# Altium project COM Board.PrjPcb (part 1 of 2)
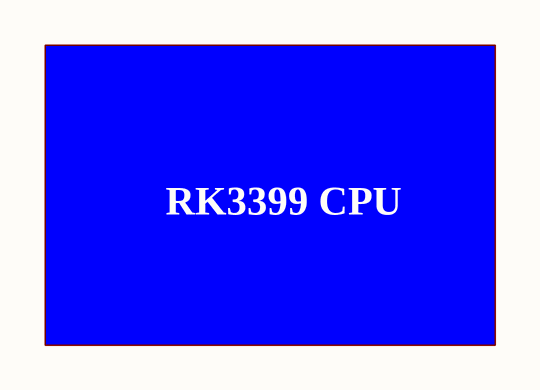
[diagram p0: Block Diagram.SchDoc]
9 sheets, 81 parts. Net scope: global (net labels, ports and power ports of the same name join across sheets).
Sheets:
  Block Diagram.SchDoc
  RK3399_LPDDR4_Pins.SchDoc
  SDRAM0.SchDoc
  SDRAM_1.SchDoc
  EMMC_RK3399.SchDoc
  PowerPins_RK3399.SchDoc
  PMIC_RK808.SchDoc
  EMMC-SDMMC-PCIe-ADC.SchDoc
  System PMU pins.SchDoc

## Sheet Block Diagram.SchDoc
size A3; SheetNumber: 1; SheetTotal: 1

### Notes on the sheet
- RK3399 CPU

## Sheet RK3399_LPDDR4_Pins.SchDoc
size A3; SheetNumber: 2; SheetTotal: 6
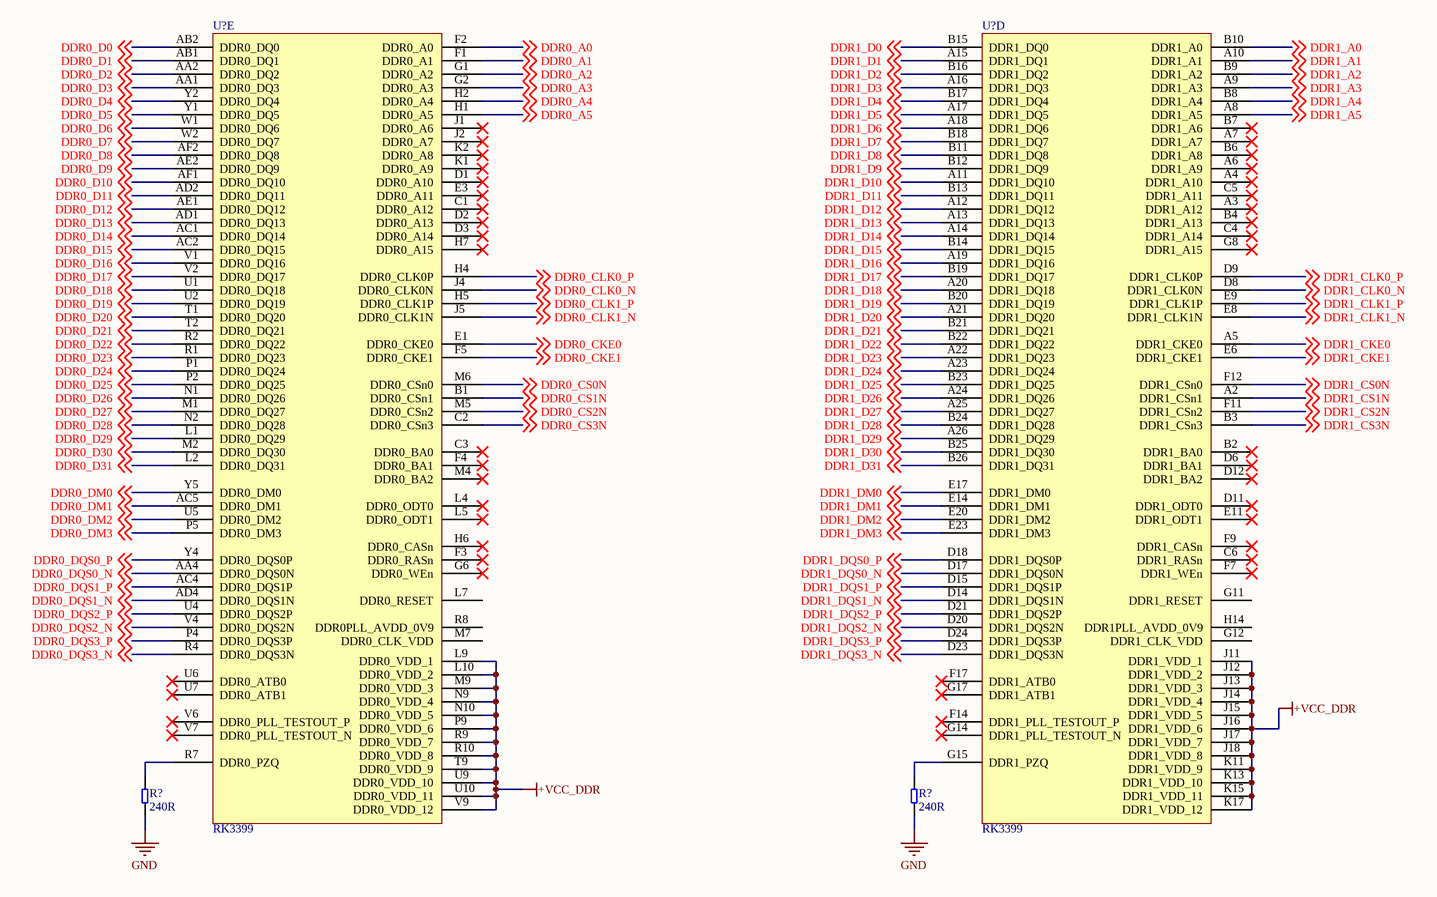
[diagram p1: RK3399_LPDDR4_Pins.SchDoc]

### Parts
(Parts that share a designator on the sheet are numbered #1, #2 ... from top to bottom, then left to right.)
R?#1  240R  [RES_0201]
R?#2  240R  [RES_0201]
U?#1  RK3399  [BGA828_RK3399]  (part E of 24)
U?#2  RK3399  [BGA828_RK3399]  (part D of 24)

### Nets
+VCC_DDR: U?#1.L9(DDR0_VDD_1) U?#1.L10(DDR0_VDD_2) U?#1.M9(DDR0_VDD_3) U?#1.N9(DDR0_VDD_4) U?#1.N10(DDR0_VDD_5) U?#1.P9(DDR0_VDD_6) U?#1.R9(DDR0_VDD_7) U?#1.R10(DDR0_VDD_8) U?#1.T9(DDR0_VDD_9) U?#1.U9(DDR0_VDD_10) U?#1.U10(DDR0_VDD_11) U?#1.V9(DDR0_VDD_12) U?#2.J11(DDR1_VDD_1) U?#2.J12(DDR1_VDD_2) U?#2.J13(DDR1_VDD_3) U?#2.J14(DDR1_VDD_4) U?#2.J15(DDR1_VDD_5) U?#2.J16(DDR1_VDD_6) U?#2.J17(DDR1_VDD_7) U?#2.J18(DDR1_VDD_8) U?#2.K11(DDR1_VDD_9) U?#2.K13(DDR1_VDD_10) U?#2.K15(DDR1_VDD_11) U?#2.K17(DDR1_VDD_12)
GND: R?#1.1 R?#2.1
DDR0_A0: U?#1.F2(DDR0_A0) ; off-sheet DDR0_A0
DDR0_A1: U?#1.F1(DDR0_A1) ; off-sheet DDR0_A1
DDR0_A2: U?#1.G1(DDR0_A2) ; off-sheet DDR0_A2
DDR0_A3: U?#1.G2(DDR0_A3) ; off-sheet DDR0_A3
DDR0_A4: U?#1.H2(DDR0_A4) ; off-sheet DDR0_A4
DDR0_A5: U?#1.H1(DDR0_A5) ; off-sheet DDR0_A5
DDR0_CKE0: U?#1.E1(DDR0_CKE0) ; off-sheet DDR0_CKE0
DDR0_CKE1: U?#1.F5(DDR0_CKE1) ; off-sheet DDR0_CKE1
DDR0_CLK0_N: U?#1.J4(DDR0_CLK0N) ; off-sheet DDR0_CLK0_N
DDR0_CLK0_P: U?#1.H4(DDR0_CLK0P) ; off-sheet DDR0_CLK0_P
DDR0_CLK1_N: U?#1.J5(DDR0_CLK1N) ; off-sheet DDR0_CLK1_N
DDR0_CLK1_P: U?#1.H5(DDR0_CLK1P) ; off-sheet DDR0_CLK1_P
DDR0_CS0N: U?#1.M6(DDR0_CSn0) ; off-sheet DDR0_CS0N
DDR0_CS1N: U?#1.B1(DDR0_CSn1) ; off-sheet DDR0_CS1N
DDR0_CS2N: U?#1.M5(DDR0_CSn2) ; off-sheet DDR0_CS2N
DDR0_CS3N: U?#1.C2(DDR0_CSn3) ; off-sheet DDR0_CS3N
DDR0_D0: U?#1.AB2(DDR0_DQ0) ; off-sheet DDR0_D0
DDR0_D1: U?#1.AB1(DDR0_DQ1) ; off-sheet DDR0_D1
DDR0_D2: U?#1.AA2(DDR0_DQ2) ; off-sheet DDR0_D2
DDR0_D3: U?#1.AA1(DDR0_DQ3) ; off-sheet DDR0_D3
DDR0_D4: U?#1.Y2(DDR0_DQ4) ; off-sheet DDR0_D4
DDR0_D5: U?#1.Y1(DDR0_DQ5) ; off-sheet DDR0_D5
DDR0_D6: U?#1.W1(DDR0_DQ6) ; off-sheet DDR0_D6
DDR0_D7: U?#1.W2(DDR0_DQ7) ; off-sheet DDR0_D7
DDR0_D8: U?#1.AF2(DDR0_DQ8) ; off-sheet DDR0_D8
DDR0_D9: U?#1.AE2(DDR0_DQ9) ; off-sheet DDR0_D9
DDR0_D10: U?#1.AF1(DDR0_DQ10) ; off-sheet DDR0_D10
DDR0_D11: U?#1.AD2(DDR0_DQ11) ; off-sheet DDR0_D11
DDR0_D12: U?#1.AE1(DDR0_DQ12) ; off-sheet DDR0_D12
DDR0_D13: U?#1.AD1(DDR0_DQ13) ; off-sheet DDR0_D13
DDR0_D14: U?#1.AC1(DDR0_DQ14) ; off-sheet DDR0_D14
DDR0_D15: U?#1.AC2(DDR0_DQ15) ; off-sheet DDR0_D15
DDR0_D16: U?#1.V1(DDR0_DQ16) ; off-sheet DDR0_D16
DDR0_D17: U?#1.V2(DDR0_DQ17) ; off-sheet DDR0_D17
DDR0_D18: U?#1.U1(DDR0_DQ18) ; off-sheet DDR0_D18
DDR0_D19: U?#1.U2(DDR0_DQ19) ; off-sheet DDR0_D19
DDR0_D20: U?#1.T1(DDR0_DQ20) ; off-sheet DDR0_D20
DDR0_D21: U?#1.T2(DDR0_DQ21) ; off-sheet DDR0_D21
DDR0_D22: U?#1.R2(DDR0_DQ22) ; off-sheet DDR0_D22
DDR0_D23: U?#1.R1(DDR0_DQ23) ; off-sheet DDR0_D23
DDR0_D24: U?#1.P1(DDR0_DQ24) ; off-sheet DDR0_D24
DDR0_D25: U?#1.P2(DDR0_DQ25) ; off-sheet DDR0_D25
DDR0_D26: U?#1.N1(DDR0_DQ26) ; off-sheet DDR0_D26
DDR0_D27: U?#1.M1(DDR0_DQ27) ; off-sheet DDR0_D27
DDR0_D28: U?#1.N2(DDR0_DQ28) ; off-sheet DDR0_D28
DDR0_D29: U?#1.L1(DDR0_DQ29) ; off-sheet DDR0_D29
DDR0_D30: U?#1.M2(DDR0_DQ30) ; off-sheet DDR0_D30
DDR0_D31: U?#1.L2(DDR0_DQ31) ; off-sheet DDR0_D31
DDR0_DM0: U?#1.Y5(DDR0_DM0) ; off-sheet DDR0_DM0
DDR0_DM1: U?#1.AC5(DDR0_DM1) ; off-sheet DDR0_DM1
DDR0_DM2: U?#1.U5(DDR0_DM2) ; off-sheet DDR0_DM2
DDR0_DM3: U?#1.P5(DDR0_DM3) ; off-sheet DDR0_DM3
DDR0_DQS0_N: U?#1.AA4(DDR0_DQS0N) ; off-sheet DDR0_DQS0_N
DDR0_DQS0_P: U?#1.Y4(DDR0_DQS0P) ; off-sheet DDR0_DQS0_P
DDR0_DQS1_N: U?#1.AD4(DDR0_DQS1N) ; off-sheet DDR0_DQS1_N
DDR0_DQS1_P: U?#1.AC4(DDR0_DQS1P) ; off-sheet DDR0_DQS1_P
DDR0_DQS2_N: U?#1.V4(DDR0_DQS2N) ; off-sheet DDR0_DQS2_N
DDR0_DQS2_P: U?#1.U4(DDR0_DQS2P) ; off-sheet DDR0_DQS2_P
DDR0_DQS3_N: U?#1.R4(DDR0_DQS3N) ; off-sheet DDR0_DQS3_N
DDR0_DQS3_P: U?#1.P4(DDR0_DQS3P) ; off-sheet DDR0_DQS3_P
DDR1_A0: U?#2.B10(DDR1_A0) ; off-sheet DDR1_A0
DDR1_A1: U?#2.A10(DDR1_A1) ; off-sheet DDR1_A1
DDR1_A2: U?#2.B9(DDR1_A2) ; off-sheet DDR1_A2
DDR1_A3: U?#2.A9(DDR1_A3) ; off-sheet DDR1_A3
DDR1_A4: U?#2.B8(DDR1_A4) ; off-sheet DDR1_A4
DDR1_A5: U?#2.A8(DDR1_A5) ; off-sheet DDR1_A5
DDR1_CKE0: U?#2.A5(DDR1_CKE0) ; off-sheet DDR1_CKE0
DDR1_CKE1: U?#2.E6(DDR1_CKE1) ; off-sheet DDR1_CKE1
DDR1_CLK0_N: U?#2.D8(DDR1_CLK0N) ; off-sheet DDR1_CLK0_N
DDR1_CLK0_P: U?#2.D9(DDR1_CLK0P) ; off-sheet DDR1_CLK0_P
DDR1_CLK1_N: U?#2.E8(DDR1_CLK1N) ; off-sheet DDR1_CLK1_N
DDR1_CLK1_P: U?#2.E9(DDR1_CLK1P) ; off-sheet DDR1_CLK1_P
DDR1_CS0N: U?#2.F12(DDR1_CSn0) ; off-sheet DDR1_CS0N
DDR1_CS1N: U?#2.A2(DDR1_CSn1) ; off-sheet DDR1_CS1N
DDR1_CS2N: U?#2.F11(DDR1_CSn2) ; off-sheet DDR1_CS2N
DDR1_CS3N: U?#2.B3(DDR1_CSn3) ; off-sheet DDR1_CS3N
DDR1_D0: U?#2.B15(DDR1_DQ0) ; off-sheet DDR1_D0
DDR1_D1: U?#2.A15(DDR1_DQ1) ; off-sheet DDR1_D1
DDR1_D2: U?#2.B16(DDR1_DQ2) ; off-sheet DDR1_D2
DDR1_D3: U?#2.A16(DDR1_DQ3) ; off-sheet DDR1_D3
DDR1_D4: U?#2.B17(DDR1_DQ4) ; off-sheet DDR1_D4
DDR1_D5: U?#2.A17(DDR1_DQ5) ; off-sheet DDR1_D5
DDR1_D6: U?#2.A18(DDR1_DQ6) ; off-sheet DDR1_D6
DDR1_D7: U?#2.B18(DDR1_DQ7) ; off-sheet DDR1_D7
DDR1_D8: U?#2.B11(DDR1_DQ8) ; off-sheet DDR1_D8
DDR1_D9: U?#2.B12(DDR1_DQ9) ; off-sheet DDR1_D9
DDR1_D10: U?#2.A11(DDR1_DQ10) ; off-sheet DDR1_D10
DDR1_D11: U?#2.B13(DDR1_DQ11) ; off-sheet DDR1_D11
DDR1_D12: U?#2.A12(DDR1_DQ12) ; off-sheet DDR1_D12
DDR1_D13: U?#2.A13(DDR1_DQ13) ; off-sheet DDR1_D13
DDR1_D14: U?#2.A14(DDR1_DQ14) ; off-sheet DDR1_D14
DDR1_D15: U?#2.B14(DDR1_DQ15) ; off-sheet DDR1_D15
DDR1_D16: U?#2.A19(DDR1_DQ16) ; off-sheet DDR1_D16
DDR1_D17: U?#2.B19(DDR1_DQ17) ; off-sheet DDR1_D17
DDR1_D18: U?#2.A20(DDR1_DQ18) ; off-sheet DDR1_D18
DDR1_D19: U?#2.B20(DDR1_DQ19) ; off-sheet DDR1_D19
DDR1_D20: U?#2.A21(DDR1_DQ20) ; off-sheet DDR1_D20
DDR1_D21: U?#2.B21(DDR1_DQ21) ; off-sheet DDR1_D21
DDR1_D22: U?#2.B22(DDR1_DQ22) ; off-sheet DDR1_D22
DDR1_D23: U?#2.A22(DDR1_DQ23) ; off-sheet DDR1_D23
DDR1_D24: U?#2.A23(DDR1_DQ24) ; off-sheet DDR1_D24
DDR1_D25: U?#2.B23(DDR1_DQ25) ; off-sheet DDR1_D25
DDR1_D26: U?#2.A24(DDR1_DQ26) ; off-sheet DDR1_D26
DDR1_D27: U?#2.A25(DDR1_DQ27) ; off-sheet DDR1_D27
DDR1_D28: U?#2.B24(DDR1_DQ28) ; off-sheet DDR1_D28
DDR1_D29: U?#2.A26(DDR1_DQ29) ; off-sheet DDR1_D29
DDR1_D30: U?#2.B25(DDR1_DQ30) ; off-sheet DDR1_D30
DDR1_D31: U?#2.B26(DDR1_DQ31) ; off-sheet DDR1_D31
DDR1_DM0: U?#2.E17(DDR1_DM0) ; off-sheet DDR1_DM0
DDR1_DM1: U?#2.E14(DDR1_DM1) ; off-sheet DDR1_DM1
DDR1_DM2: U?#2.E20(DDR1_DM2) ; off-sheet DDR1_DM2
DDR1_DM3: U?#2.E23(DDR1_DM3) ; off-sheet DDR1_DM3
DDR1_DQS0_N: U?#2.D17(DDR1_DQS0N) ; off-sheet DDR1_DQS0_N
DDR1_DQS0_P: U?#2.D18(DDR1_DQS0P) ; off-sheet DDR1_DQS0_P
DDR1_DQS1_N: U?#2.D14(DDR1_DQS1N) ; off-sheet DDR1_DQS1_N
DDR1_DQS1_P: U?#2.D15(DDR1_DQS1P) ; off-sheet DDR1_DQS1_P
DDR1_DQS2_N: U?#2.D20(DDR1_DQS2N) ; off-sheet DDR1_DQS2_N
DDR1_DQS2_P: U?#2.D21(DDR1_DQS2P) ; off-sheet DDR1_DQS2_P
DDR1_DQS3_N: U?#2.D23(DDR1_DQS3N) ; off-sheet DDR1_DQS3_N
DDR1_DQS3_P: U?#2.D24(DDR1_DQS3P) ; off-sheet DDR1_DQS3_P
NetR?#1_2: R?#1.2 U?#1.R7(DDR0_PZQ)
NetR?#2_2: R?#2.2 U?#2.G15(DDR1_PZQ)

Not connected (* = marked no-connect by the designer): U?#1 C1(DDR0_A12)* C3(DDR0_BA0)* D1(DDR0_A10)* D2(DDR0_A13)* D3(DDR0_A14)* E3(DDR0_A11)* F3(DDR0_RASn)* F4(DDR0_BA1)* G6(DDR0_WEn)* H6(DDR0_CASn)* H7(DDR0_A15)* J1(DDR0_A6)* J2(DDR0_A7)* K1(DDR0_A9)* K2(DDR0_A8)* L4(DDR0_ODT0)* L5(DDR0_ODT1)* L7(DDR0_RESET) M4(DDR0_BA2)* M7(DDR0_CLK_VDD) R8(DDR0PLL_AVDD_0V9) U6(DDR0_ATB0)* U7(DDR0_ATB1)* V6(DDR0_PLL_TESTOUT_P)* V7(DDR0_PLL_TESTOUT_N)*; U?#2 A3(DDR1_A12)* A4(DDR1_A10)* A6(DDR1_A9)* A7(DDR1_A7)* B2(DDR1_BA0)* B4(DDR1_A13)* B6(DDR1_A8)* B7(DDR1_A6)* C4(DDR1_A14)* C5(DDR1_A11)* C6(DDR1_RASn)* D6(DDR1_BA1)* D11(DDR1_ODT0)* D12(DDR1_BA2)* E11(DDR1_ODT1)* F7(DDR1_WEn)* F9(DDR1_CASn)* F14(DDR1_PLL_TESTOUT_P)* F17(DDR1_ATB0)* G8(DDR1_A15)* G11(DDR1_RESET) G12(DDR1_CLK_VDD) G14(DDR1_PLL_TESTOUT_N)* G17(DDR1_ATB1)* H14(DDR1PLL_AVDD_0V9)

### Library data of the parts
R?#1 R?#2 = RES_240R-0.05W-1%-0201: 240 Ohms ±1% 0.05W, 1/20W Chip Resistor 0201 (0603 Metric) Thick Film /; Manufacturer: Yageo; Manufacturer Part Number: RC0201FR-07240RL; Case/Package: 0201; Supplier-1: Digikey
U?#1 U?#2 = IC_RK3399-FCBGA828: RK3399 is a low power, high performance processor for computing, personal mobile.; Manufacturer: Rockchip; Manufacturer Part Number: RK3399; Case/Package: FCBGA828; Supplier-1: Rockchip

## Sheet SDRAM0.SchDoc
size A3; SheetNumber: 3; SheetTotal: 6
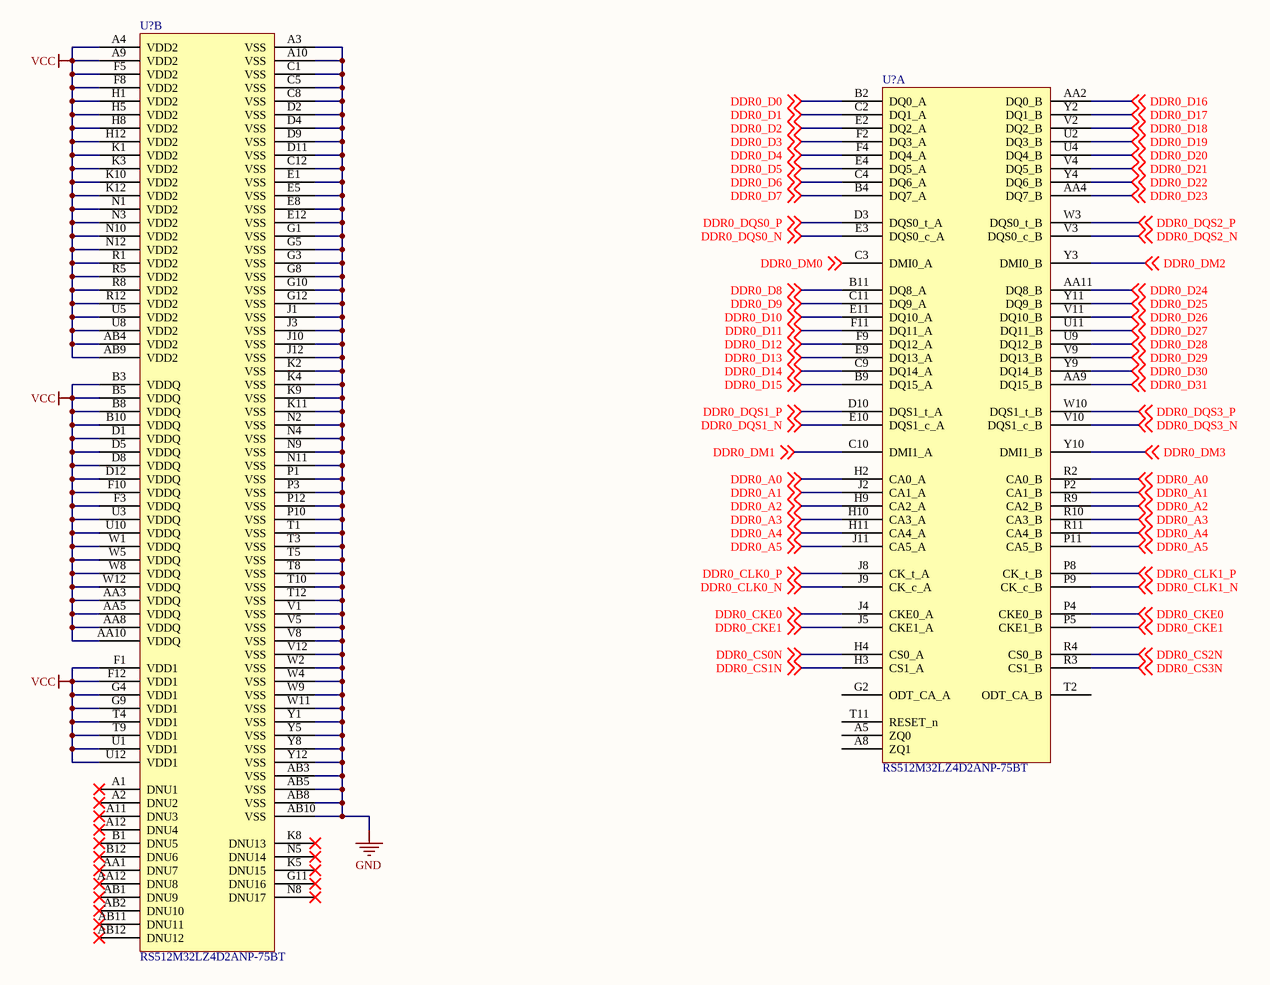
[diagram p2: SDRAM0.SchDoc]

### Parts
(Parts that share a designator on the sheet are numbered #1, #2 ... from top to bottom, then left to right.)
U?#3  RS512M32LZ4D2ANP-75BT  [FBGA200_SMD]  (part B of 2)
U?#4  RS512M32LZ4D2ANP-75BT  [FBGA200_SMD]  (part A of 2)

### Nets
GND: U?#3.A3(VSS) U?#3.A10(VSS) U?#3.AB3(VSS) U?#3.AB5(VSS) U?#3.AB8(VSS) U?#3.AB10(VSS) U?#3.C1(VSS) U?#3.C5(VSS) U?#3.C8(VSS) U?#3.C12(VSS) U?#3.D2(VSS) U?#3.D4(VSS) U?#3.D9(VSS) U?#3.D11(VSS) U?#3.E1(VSS) U?#3.E5(VSS) U?#3.E8(VSS) U?#3.E12(VSS) U?#3.G1(VSS) U?#3.G3(VSS) U?#3.G5(VSS) U?#3.G8(VSS) U?#3.G10(VSS) U?#3.G12(VSS) U?#3.J1(VSS) U?#3.J3(VSS) U?#3.J10(VSS) U?#3.J12(VSS) U?#3.K2(VSS) U?#3.K4(VSS) U?#3.K9(VSS) U?#3.K11(VSS) U?#3.N2(VSS) U?#3.N4(VSS) U?#3.N9(VSS) U?#3.N11(VSS) U?#3.P1(VSS) U?#3.P3(VSS) U?#3.P10(VSS) U?#3.P12(VSS) U?#3.T1(VSS) U?#3.T3(VSS) U?#3.T5(VSS) U?#3.T8(VSS) U?#3.T10(VSS) U?#3.T12(VSS) U?#3.V1(VSS) U?#3.V5(VSS) U?#3.V8(VSS) U?#3.V12(VSS) U?#3.W2(VSS) U?#3.W4(VSS) U?#3.W9(VSS) U?#3.W11(VSS) U?#3.Y1(VSS) U?#3.Y5(VSS) U?#3.Y8(VSS) U?#3.Y12(VSS)
VCC: U?#3.A4(VDD2) U?#3.A9(VDD2) U?#3.AA3(VDDQ) U?#3.AA5(VDDQ) U?#3.AA8(VDDQ) U?#3.AA10(VDDQ) U?#3.AB4(VDD2) U?#3.AB9(VDD2) U?#3.B3(VDDQ) U?#3.B5(VDDQ) U?#3.B8(VDDQ) U?#3.B10(VDDQ) U?#3.D1(VDDQ) U?#3.D5(VDDQ) U?#3.D8(VDDQ) U?#3.D12(VDDQ) U?#3.F1(VDD1) U?#3.F3(VDDQ) U?#3.F5(VDD2) U?#3.F8(VDD2) U?#3.F10(VDDQ) U?#3.F12(VDD1) U?#3.G4(VDD1) U?#3.G9(VDD1) U?#3.H1(VDD2) U?#3.H5(VDD2) U?#3.H8(VDD2) U?#3.H12(VDD2) U?#3.K1(VDD2) U?#3.K3(VDD2) U?#3.K10(VDD2) U?#3.K12(VDD2) U?#3.N1(VDD2) U?#3.N3(VDD2) U?#3.N10(VDD2) U?#3.N12(VDD2) U?#3.R1(VDD2) U?#3.R5(VDD2) U?#3.R8(VDD2) U?#3.R12(VDD2) U?#3.T4(VDD1) U?#3.T9(VDD1) U?#3.U1(VDD1) U?#3.U3(VDDQ) U?#3.U5(VDD2) U?#3.U8(VDD2) U?#3.U10(VDDQ) U?#3.U12(VDD1) U?#3.W1(VDDQ) U?#3.W5(VDDQ) U?#3.W8(VDDQ) U?#3.W12(VDDQ)
DDR0_A0: U?#4.H2(CA0_A) U?#4.R2(CA0_B) ; off-sheet DDR0_A0
DDR0_A1: U?#4.J2(CA1_A) U?#4.P2(CA1_B) ; off-sheet DDR0_A1
DDR0_A2: U?#4.H9(CA2_A) U?#4.R9(CA2_B) ; off-sheet DDR0_A2
DDR0_A3: U?#4.H10(CA3_A) U?#4.R10(CA3_B) ; off-sheet DDR0_A3
DDR0_A4: U?#4.H11(CA4_A) U?#4.R11(CA4_B) ; off-sheet DDR0_A4
DDR0_A5: U?#4.J11(CA5_A) U?#4.P11(CA5_B) ; off-sheet DDR0_A5
DDR0_CKE0: U?#4.J4(CKE0_A) U?#4.P4(CKE0_B) ; off-sheet DDR0_CKE0
DDR0_CKE1: U?#4.J5(CKE1_A) U?#4.P5(CKE1_B) ; off-sheet DDR0_CKE1
DDR0_CLK0_N: U?#4.J9(CK_c_A) ; off-sheet DDR0_CLK0_N
DDR0_CLK0_P: U?#4.J8(CK_t_A) ; off-sheet DDR0_CLK0_P
DDR0_CLK1_N: U?#4.P9(CK_c_B) ; off-sheet DDR0_CLK1_N
DDR0_CLK1_P: U?#4.P8(CK_t_B) ; off-sheet DDR0_CLK1_P
DDR0_CS0N: U?#4.H4(CS0_A) ; off-sheet DDR0_CS0N
DDR0_CS1N: U?#4.H3(CS1_A) ; off-sheet DDR0_CS1N
DDR0_CS2N: U?#4.R4(CS0_B) ; off-sheet DDR0_CS2N
DDR0_CS3N: U?#4.R3(CS1_B) ; off-sheet DDR0_CS3N
DDR0_D0: U?#4.B2(DQ0_A) ; off-sheet DDR0_D0
DDR0_D1: U?#4.C2(DQ1_A) ; off-sheet DDR0_D1
DDR0_D2: U?#4.E2(DQ2_A) ; off-sheet DDR0_D2
DDR0_D3: U?#4.F2(DQ3_A) ; off-sheet DDR0_D3
DDR0_D4: U?#4.F4(DQ4_A) ; off-sheet DDR0_D4
DDR0_D5: U?#4.E4(DQ5_A) ; off-sheet DDR0_D5
DDR0_D6: U?#4.C4(DQ6_A) ; off-sheet DDR0_D6
DDR0_D7: U?#4.B4(DQ7_A) ; off-sheet DDR0_D7
DDR0_D8: U?#4.B11(DQ8_A) ; off-sheet DDR0_D8
DDR0_D9: U?#4.C11(DQ9_A) ; off-sheet DDR0_D9
DDR0_D10: U?#4.E11(DQ10_A) ; off-sheet DDR0_D10
DDR0_D11: U?#4.F11(DQ11_A) ; off-sheet DDR0_D11
DDR0_D12: U?#4.F9(DQ12_A) ; off-sheet DDR0_D12
DDR0_D13: U?#4.E9(DQ13_A) ; off-sheet DDR0_D13
DDR0_D14: U?#4.C9(DQ14_A) ; off-sheet DDR0_D14
DDR0_D15: U?#4.B9(DQ15_A) ; off-sheet DDR0_D15
DDR0_D16: U?#4.AA2(DQ0_B) ; off-sheet DDR0_D16
DDR0_D17: U?#4.Y2(DQ1_B) ; off-sheet DDR0_D17
DDR0_D18: U?#4.V2(DQ2_B) ; off-sheet DDR0_D18
DDR0_D19: U?#4.U2(DQ3_B) ; off-sheet DDR0_D19
DDR0_D20: U?#4.U4(DQ4_B) ; off-sheet DDR0_D20
DDR0_D21: U?#4.V4(DQ5_B) ; off-sheet DDR0_D21
DDR0_D22: U?#4.Y4(DQ6_B) ; off-sheet DDR0_D22
DDR0_D23: U?#4.AA4(DQ7_B) ; off-sheet DDR0_D23
DDR0_D24: U?#4.AA11(DQ8_B) ; off-sheet DDR0_D24
DDR0_D25: U?#4.Y11(DQ9_B) ; off-sheet DDR0_D25
DDR0_D26: U?#4.V11(DQ10_B) ; off-sheet DDR0_D26
DDR0_D27: U?#4.U11(DQ11_B) ; off-sheet DDR0_D27
DDR0_D28: U?#4.U9(DQ12_B) ; off-sheet DDR0_D28
DDR0_D29: U?#4.V9(DQ13_B) ; off-sheet DDR0_D29
DDR0_D30: U?#4.Y9(DQ14_B) ; off-sheet DDR0_D30
DDR0_D31: U?#4.AA9(DQ15_B) ; off-sheet DDR0_D31
DDR0_DM0: U?#4.C3(DMI0_A) ; off-sheet DDR0_DM0
DDR0_DM1: U?#4.C10(DMI1_A) ; off-sheet DDR0_DM1
DDR0_DM2: U?#4.Y3(DMI0_B) ; off-sheet DDR0_DM2
DDR0_DM3: U?#4.Y10(DMI1_B) ; off-sheet DDR0_DM3
DDR0_DQS0_N: U?#4.E3(DQS0_c_A) ; off-sheet DDR0_DQS0_N
DDR0_DQS0_P: U?#4.D3(DQS0_t_A) ; off-sheet DDR0_DQS0_P
DDR0_DQS1_N: U?#4.E10(DQS1_c_A) ; off-sheet DDR0_DQS1_N
DDR0_DQS1_P: U?#4.D10(DQS1_t_A) ; off-sheet DDR0_DQS1_P
DDR0_DQS2_N: U?#4.V3(DQS0_c_B) ; off-sheet DDR0_DQS2_N
DDR0_DQS2_P: U?#4.W3(DQS0_t_B) ; off-sheet DDR0_DQS2_P
DDR0_DQS3_N: U?#4.V10(DQS1_c_B) ; off-sheet DDR0_DQS3_N
DDR0_DQS3_P: U?#4.W10(DQS1_t_B) ; off-sheet DDR0_DQS3_P

Not connected (* = marked no-connect by the designer): U?#3 A1(DNU1)* A2(DNU2)* A11(DNU3)* A12(DNU4)* AA1(DNU7)* AA12(DNU8)* AB1(DNU9)* AB2(DNU10)* AB11(DNU11)* AB12(DNU12)* B1(DNU5)* B12(DNU6)* G11(DNU16)* K5(DNU15)* K8(DNU13)* N5(DNU14)* N8(DNU17)*; U?#4 A5(ZQ0) A8(ZQ1) G2(ODT_CA_A) T2(ODT_CA_B) T11(RESET_n)

### Library data of the parts
U?#3 U?#4 = IC_RS512M32LZ4D2ANP-75BT: LPDDR4/4X Package FBGA 200b Density 4Gbit~64Gbit Operating Temperature Range：-25~85℃ Speed：2667Mbps/3200Mbps/3733Mbps Voltage：VDD1/VDD2/VDDQ= 1.8 / 1.1 / 1.1 V（LPDDR4）VDD1/VDD2/VDDQ = 1.8 / 1.1 / 0.6 V（LPDDR4X）Approved Verification Platform：MTK、Spreadtrum; Manufacturer: RAYSON; Manufacturer Part Number: RS512M32LZ4D2ANP-75BT; Case/Package: FBGA 200b; Supplier-1: RAYSON

## Sheet SDRAM_1.SchDoc
size A3; SheetNumber: 4; SheetTotal: 6
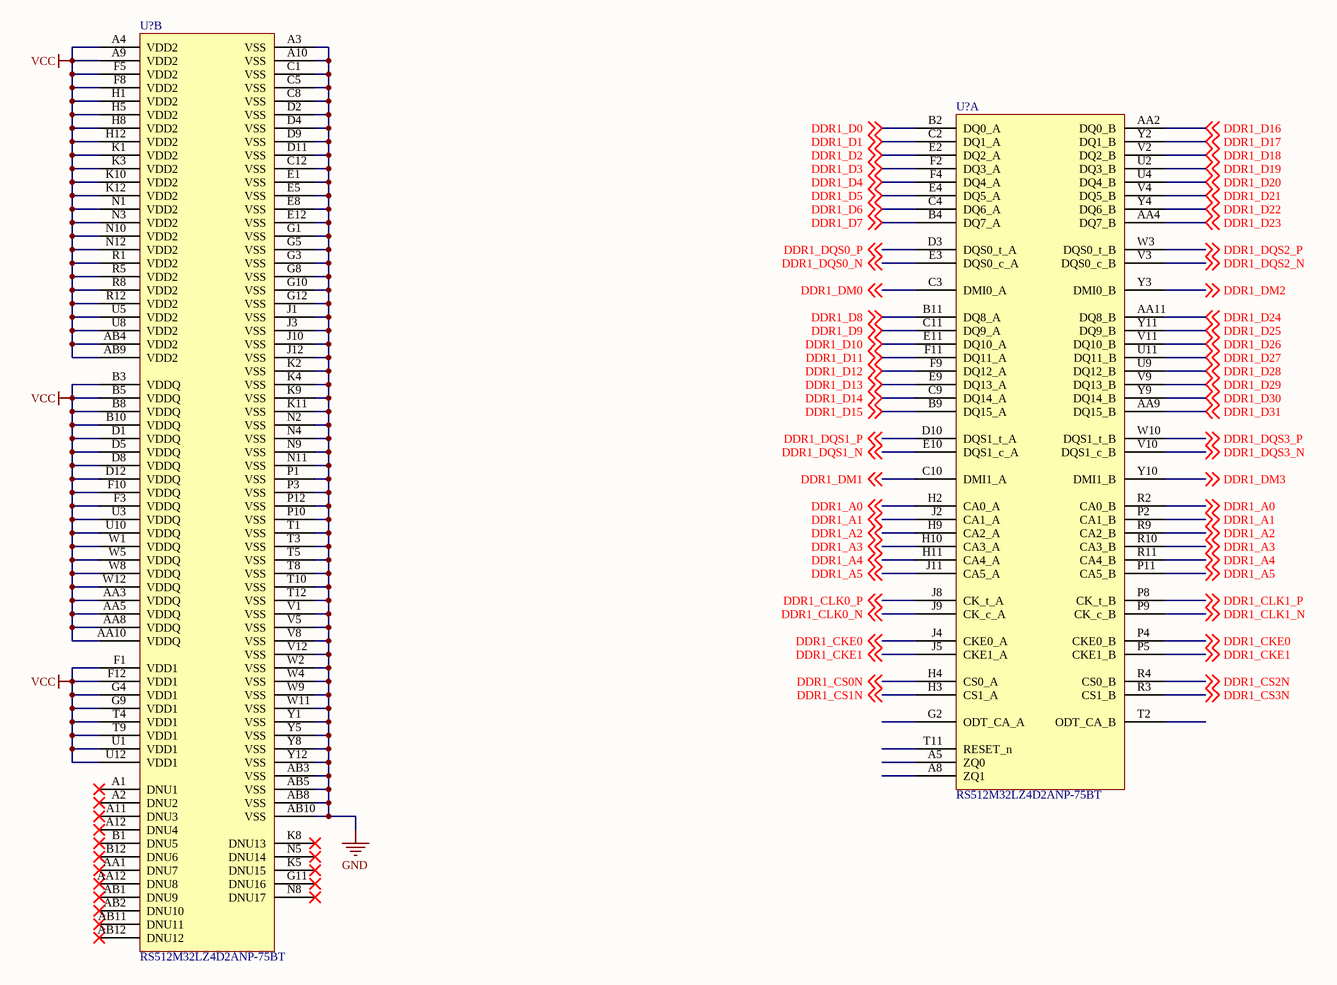
[diagram p3: SDRAM_1.SchDoc]

### Parts
(Parts that share a designator on the sheet are numbered #1, #2 ... from top to bottom, then left to right.)
U?#5  RS512M32LZ4D2ANP-75BT  [FBGA200_SMD]  (part B of 2)
U?#6  RS512M32LZ4D2ANP-75BT  [FBGA200_SMD]  (part A of 2)

### Nets
GND: U?#5.A3(VSS) U?#5.A10(VSS) U?#5.AB3(VSS) U?#5.AB5(VSS) U?#5.AB8(VSS) U?#5.AB10(VSS) U?#5.C1(VSS) U?#5.C5(VSS) U?#5.C8(VSS) U?#5.C12(VSS) U?#5.D2(VSS) U?#5.D4(VSS) U?#5.D9(VSS) U?#5.D11(VSS) U?#5.E1(VSS) U?#5.E5(VSS) U?#5.E8(VSS) U?#5.E12(VSS) U?#5.G1(VSS) U?#5.G3(VSS) U?#5.G5(VSS) U?#5.G8(VSS) U?#5.G10(VSS) U?#5.G12(VSS) U?#5.J1(VSS) U?#5.J3(VSS) U?#5.J10(VSS) U?#5.J12(VSS) U?#5.K2(VSS) U?#5.K4(VSS) U?#5.K9(VSS) U?#5.K11(VSS) U?#5.N2(VSS) U?#5.N4(VSS) U?#5.N9(VSS) U?#5.N11(VSS) U?#5.P1(VSS) U?#5.P3(VSS) U?#5.P10(VSS) U?#5.P12(VSS) U?#5.T1(VSS) U?#5.T3(VSS) U?#5.T5(VSS) U?#5.T8(VSS) U?#5.T10(VSS) U?#5.T12(VSS) U?#5.V1(VSS) U?#5.V5(VSS) U?#5.V8(VSS) U?#5.V12(VSS) U?#5.W2(VSS) U?#5.W4(VSS) U?#5.W9(VSS) U?#5.W11(VSS) U?#5.Y1(VSS) U?#5.Y5(VSS) U?#5.Y8(VSS) U?#5.Y12(VSS)
VCC: U?#5.A4(VDD2) U?#5.A9(VDD2) U?#5.AA3(VDDQ) U?#5.AA5(VDDQ) U?#5.AA8(VDDQ) U?#5.AA10(VDDQ) U?#5.AB4(VDD2) U?#5.AB9(VDD2) U?#5.B3(VDDQ) U?#5.B5(VDDQ) U?#5.B8(VDDQ) U?#5.B10(VDDQ) U?#5.D1(VDDQ) U?#5.D5(VDDQ) U?#5.D8(VDDQ) U?#5.D12(VDDQ) U?#5.F1(VDD1) U?#5.F3(VDDQ) U?#5.F5(VDD2) U?#5.F8(VDD2) U?#5.F10(VDDQ) U?#5.F12(VDD1) U?#5.G4(VDD1) U?#5.G9(VDD1) U?#5.H1(VDD2) U?#5.H5(VDD2) U?#5.H8(VDD2) U?#5.H12(VDD2) U?#5.K1(VDD2) U?#5.K3(VDD2) U?#5.K10(VDD2) U?#5.K12(VDD2) U?#5.N1(VDD2) U?#5.N3(VDD2) U?#5.N10(VDD2) U?#5.N12(VDD2) U?#5.R1(VDD2) U?#5.R5(VDD2) U?#5.R8(VDD2) U?#5.R12(VDD2) U?#5.T4(VDD1) U?#5.T9(VDD1) U?#5.U1(VDD1) U?#5.U3(VDDQ) U?#5.U5(VDD2) U?#5.U8(VDD2) U?#5.U10(VDDQ) U?#5.U12(VDD1) U?#5.W1(VDDQ) U?#5.W5(VDDQ) U?#5.W8(VDDQ) U?#5.W12(VDDQ)
DDR1_A0: U?#6.H2(CA0_A) U?#6.R2(CA0_B) ; off-sheet DDR1_A0
DDR1_A1: U?#6.J2(CA1_A) U?#6.P2(CA1_B) ; off-sheet DDR1_A1
DDR1_A2: U?#6.H9(CA2_A) U?#6.R9(CA2_B) ; off-sheet DDR1_A2
DDR1_A3: U?#6.H10(CA3_A) U?#6.R10(CA3_B) ; off-sheet DDR1_A3
DDR1_A4: U?#6.H11(CA4_A) U?#6.R11(CA4_B) ; off-sheet DDR1_A4
DDR1_A5: U?#6.J11(CA5_A) U?#6.P11(CA5_B) ; off-sheet DDR1_A5
DDR1_CKE0: U?#6.J4(CKE0_A) U?#6.P4(CKE0_B) ; off-sheet DDR1_CKE0
DDR1_CKE1: U?#6.J5(CKE1_A) U?#6.P5(CKE1_B) ; off-sheet DDR1_CKE1
DDR1_CLK0_N: U?#6.J9(CK_c_A) ; off-sheet DDR1_CLK0_N
DDR1_CLK0_P: U?#6.J8(CK_t_A) ; off-sheet DDR1_CLK0_P
DDR1_CLK1_N: U?#6.P9(CK_c_B) ; off-sheet DDR1_CLK1_N
DDR1_CLK1_P: U?#6.P8(CK_t_B) ; off-sheet DDR1_CLK1_P
DDR1_CS0N: U?#6.H4(CS0_A) ; off-sheet DDR1_CS0N
DDR1_CS1N: U?#6.H3(CS1_A) ; off-sheet DDR1_CS1N
DDR1_CS2N: U?#6.R4(CS0_B) ; off-sheet DDR1_CS2N
DDR1_CS3N: U?#6.R3(CS1_B) ; off-sheet DDR1_CS3N
DDR1_D0: U?#6.B2(DQ0_A) ; off-sheet DDR1_D0
DDR1_D1: U?#6.C2(DQ1_A) ; off-sheet DDR1_D1
DDR1_D2: U?#6.E2(DQ2_A) ; off-sheet DDR1_D2
DDR1_D3: U?#6.F2(DQ3_A) ; off-sheet DDR1_D3
DDR1_D4: U?#6.F4(DQ4_A) ; off-sheet DDR1_D4
DDR1_D5: U?#6.E4(DQ5_A) ; off-sheet DDR1_D5
DDR1_D6: U?#6.C4(DQ6_A) ; off-sheet DDR1_D6
DDR1_D7: U?#6.B4(DQ7_A) ; off-sheet DDR1_D7
DDR1_D8: U?#6.B11(DQ8_A) ; off-sheet DDR1_D8
DDR1_D9: U?#6.C11(DQ9_A) ; off-sheet DDR1_D9
DDR1_D10: U?#6.E11(DQ10_A) ; off-sheet DDR1_D10
DDR1_D11: U?#6.F11(DQ11_A) ; off-sheet DDR1_D11
DDR1_D12: U?#6.F9(DQ12_A) ; off-sheet DDR1_D12
DDR1_D13: U?#6.E9(DQ13_A) ; off-sheet DDR1_D13
DDR1_D14: U?#6.C9(DQ14_A) ; off-sheet DDR1_D14
DDR1_D15: U?#6.B9(DQ15_A) ; off-sheet DDR1_D15
DDR1_D16: U?#6.AA2(DQ0_B) ; off-sheet DDR1_D16
DDR1_D17: U?#6.Y2(DQ1_B) ; off-sheet DDR1_D17
DDR1_D18: U?#6.V2(DQ2_B) ; off-sheet DDR1_D18
DDR1_D19: U?#6.U2(DQ3_B) ; off-sheet DDR1_D19
DDR1_D20: U?#6.U4(DQ4_B) ; off-sheet DDR1_D20
DDR1_D21: U?#6.V4(DQ5_B) ; off-sheet DDR1_D21
DDR1_D22: U?#6.Y4(DQ6_B) ; off-sheet DDR1_D22
DDR1_D23: U?#6.AA4(DQ7_B) ; off-sheet DDR1_D23
DDR1_D24: U?#6.AA11(DQ8_B) ; off-sheet DDR1_D24
DDR1_D25: U?#6.Y11(DQ9_B) ; off-sheet DDR1_D25
DDR1_D26: U?#6.V11(DQ10_B) ; off-sheet DDR1_D26
DDR1_D27: U?#6.U11(DQ11_B) ; off-sheet DDR1_D27
DDR1_D28: U?#6.U9(DQ12_B) ; off-sheet DDR1_D28
DDR1_D29: U?#6.V9(DQ13_B) ; off-sheet DDR1_D29
DDR1_D30: U?#6.Y9(DQ14_B) ; off-sheet DDR1_D30
DDR1_D31: U?#6.AA9(DQ15_B) ; off-sheet DDR1_D31
DDR1_DM0: U?#6.C3(DMI0_A) ; off-sheet DDR1_DM0
DDR1_DM1: U?#6.C10(DMI1_A) ; off-sheet DDR1_DM1
DDR1_DM2: U?#6.Y3(DMI0_B) ; off-sheet DDR1_DM2
DDR1_DM3: U?#6.Y10(DMI1_B) ; off-sheet DDR1_DM3
DDR1_DQS0_N: U?#6.E3(DQS0_c_A) ; off-sheet DDR1_DQS0_N
DDR1_DQS0_P: U?#6.D3(DQS0_t_A) ; off-sheet DDR1_DQS0_P
DDR1_DQS1_N: U?#6.E10(DQS1_c_A) ; off-sheet DDR1_DQS1_N
DDR1_DQS1_P: U?#6.D10(DQS1_t_A) ; off-sheet DDR1_DQS1_P
DDR1_DQS2_N: U?#6.V3(DQS0_c_B) ; off-sheet DDR1_DQS2_N
DDR1_DQS2_P: U?#6.W3(DQS0_t_B) ; off-sheet DDR1_DQS2_P
DDR1_DQS3_N: U?#6.V10(DQS1_c_B) ; off-sheet DDR1_DQS3_N
DDR1_DQS3_P: U?#6.W10(DQS1_t_B) ; off-sheet DDR1_DQS3_P

Not connected (* = marked no-connect by the designer): U?#5 A1(DNU1)* A2(DNU2)* A11(DNU3)* A12(DNU4)* AA1(DNU7)* AA12(DNU8)* AB1(DNU9)* AB2(DNU10)* AB11(DNU11)* AB12(DNU12)* B1(DNU5)* B12(DNU6)* G11(DNU16)* K5(DNU15)* K8(DNU13)* N5(DNU14)* N8(DNU17)*; U?#6 A5(ZQ0) A8(ZQ1) G2(ODT_CA_A) T2(ODT_CA_B) T11(RESET_n)

### Library data of the parts
U?#5 U?#6 = IC_RS512M32LZ4D2ANP-75BT: as U?#3 on sheet SDRAM0; Manufacturer Part Number: RS512M32LZ4D2ANP-75BT; Case/Package: FBGA 200b; Supplier-1: RAYSON

## Sheet EMMC_RK3399.SchDoc
size A3; SheetNumber: 5; SheetTotal: 6
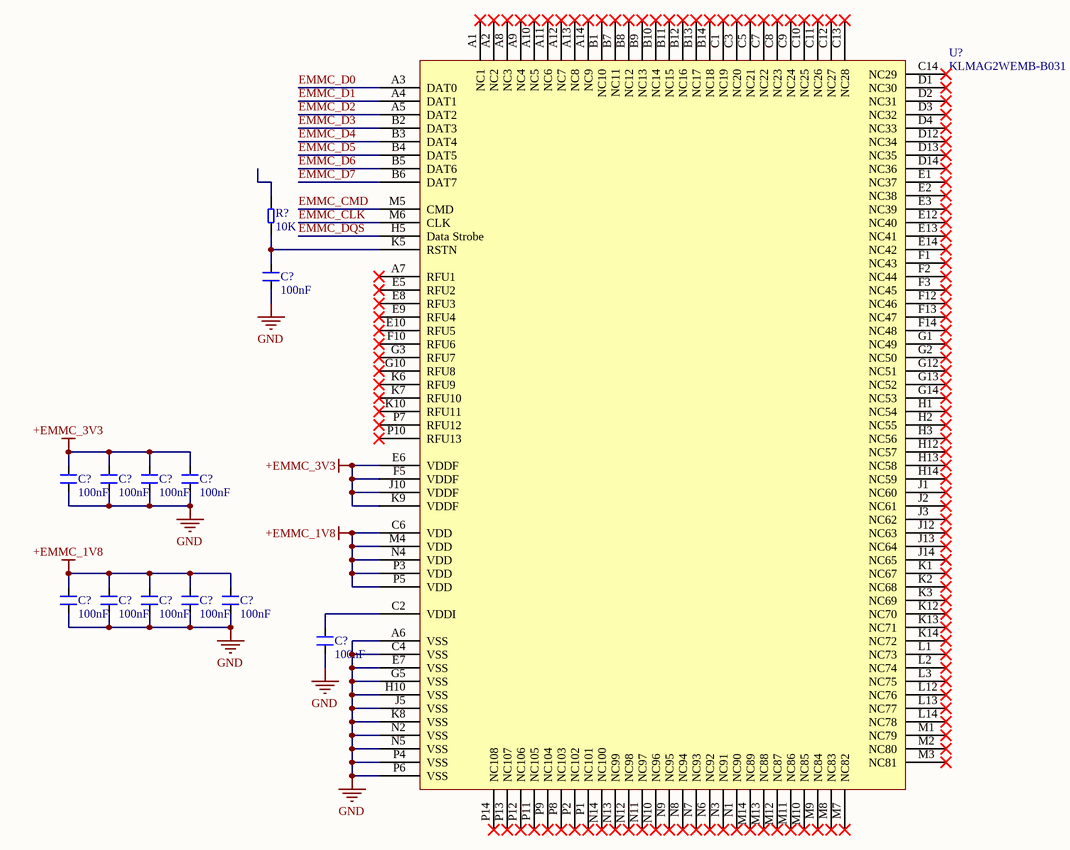
[diagram p4: EMMC_RK3399.SchDoc]

### Parts
(Parts that share a designator on the sheet are numbered #1, #2 ... from top to bottom, then left to right.)
C?#1  100nF  [CAP_0201]
C?#2  100nF  [CAP_0201]
C?#3  100nF  [CAP_0201]
C?#4  100nF  [CAP_0201]
C?#5  100nF  [CAP_0201]
C?#6  100nF  [CAP_0201]
C?#7  100nF  [CAP_0201]
C?#8  100nF  [CAP_0201]
C?#9  100nF  [CAP_0201]
C?#10  100nF  [CAP_0201]
C?#11  100nF  [CAP_0201]
R?#3  10K  [RES_0201]
U?#7  KLMAG2WEMB-B031  [BGA153_IC_KLMAG2WEMB-B031]

### Nets
+EMMC_1V8: C?#6.2 C?#7.2 C?#8.2 C?#9.2 C?#10.2 U?#7.C6(VDD) U?#7.M4(VDD) U?#7.N4(VDD) U?#7.P3(VDD) U?#7.P5(VDD)
+EMMC_3V3: C?#2.2 C?#3.2 C?#4.2 C?#5.2 U?#7.E6(VDDF) U?#7.F5(VDDF) U?#7.J10(VDDF) U?#7.K9(VDDF)
GND: C?#1.1 C?#2.1 C?#3.1 C?#4.1 C?#5.1 C?#6.1 C?#7.1 C?#8.1 C?#9.1 C?#10.1 C?#11.1 U?#7.A6(VSS) U?#7.C4(VSS) U?#7.E7(VSS) U?#7.G5(VSS) U?#7.H10(VSS) U?#7.J5(VSS) U?#7.K8(VSS) U?#7.N2(VSS) U?#7.N5(VSS) U?#7.P4(VSS) U?#7.P6(VSS)
EMMC_CLK: U?#7.M6(CLK)
EMMC_CMD: U?#7.M5(CMD)
EMMC_D0: U?#7.A3(DAT0)
EMMC_D1: U?#7.A4(DAT1)
EMMC_D2: U?#7.A5(DAT2)
EMMC_D3: U?#7.B2(DAT3)
EMMC_D4: U?#7.B3(DAT4)
EMMC_D5: U?#7.B4(DAT5)
EMMC_D6: U?#7.B5(DAT6)
EMMC_D7: U?#7.B6(DAT7)
EMMC_DQS: U?#7.H5(Data_Strobe)
NetC?#1_2: C?#1.2 R?#3.1 U?#7.K5(RSTN)
NetC?#11_2: C?#11.2 U?#7.C2(VDDI)

Not connected (* = marked no-connect by the designer): R?#3 2; U?#7 A1(NC1)* A2(NC2)* A7(RFU1)* A8(NC3)* A9(NC4)* A10(NC5)* A11(NC6)* A12(NC7)* A13(NC8)* A14(NC9)* B1(NC10)* B7(NC11)* B8(NC12)* B9(NC13)* B10(NC14)* B11(NC15)* B12(NC16)* B13(NC17)* B14(NC18)* C1(NC19)* C3(NC20)* C5(NC21)* C7(NC22)* C8(NC23)* C9(NC24)* C10(NC25)* C11(NC26)* C12(NC27)* C13(NC28)* C14(NC29)* D1(NC30)* D2(NC31)* D3(NC32)* D4(NC33)* D12(NC34)* D13(NC35)* D14(NC36)* E1(NC37)* E2(NC38)* E3(NC39)* E5(RFU2)* E8(RFU3)* E9(RFU4)* E10(RFU5)* E12(NC40)* E13(NC41)* E14(NC42)* F1(NC43)* F2(NC44)* F3(NC45)* F10(RFU6)* F12(NC46)* F13(NC47)* F14(NC48)* G1(NC49)* G2(NC50)* G3(RFU7)* G10(RFU8)* G12(NC51)* G13(NC52)* G14(NC53)* H1(NC54)* H2(NC55)* H3(NC56)* H12(NC57)* H13(NC58)* H14(NC59)* J1(NC60)* J2(NC61)* J3(NC62)* J12(NC63)* J13(NC64)* J14(NC65)* K1(NC67)* K2(NC68)* K3(NC69)* K6(RFU9)* K7(RFU10)* K10(RFU11)* K12(NC70)* K13(NC71)* K14(NC72)* L1(NC73)* L2(NC74)* L3(NC75)* L12(NC76)* L13(NC77)* L14(NC78)* M1(NC79)* M2(NC80)* M3(NC81)* M7(NC82)* M8(NC83)* M9(NC84)* M10(NC85)* M11(NC86)* M12(NC87)* M13(NC88)* M14(NC89)* N1(NC90)* N3(NC91)* N6(NC92)* N7(NC93)* N8(NC94)* N9(NC95)* N10(NC96)* N11(NC97)* N12(NC98)* N13(NC99)* N14(NC100)* P1(NC101)* P2(NC102)* P7(RFU12)* P8(NC103)* P9(NC104)* P10(RFU13)* P11(NC105)* P12(NC106)* P13(NC107)* P14(NC108)*

### Library data of the parts
C?#1-C?#11 = CAP_100nF-25V-10%-0201: Multilayer Ceramic Capacitor, 0.1 uF, 25 V, ± 10%, X5R, 0201 [0603 Metric]; Manufacturer: TDK Corporation; Manufacturer Part Number: C0603X5R1E104K030BB; Manufacturer 1: TDK; Voltage Rating: 25V; Case/Package: 0201; Supplier-1: Digikey; Supplier 1: Digi-Key; Manufacturer Part Number 1: C0603X5R1E104K030BB; RoHS: Yes; Category: Ceramic Capacitors; Stock 1: 525939; Pricing 1: 1=0.1, 10=0.069, 50=0.0376, 100=0.0307, 500=0.02192, 1000=0.01722, 2500=0.01566, 5000=0.0144 (USD); Mount: Surface Mount; Case Code (Metric): 0603; Case Code (Imperial): 0201; Weight: 6E-06oz; Dielectric Material: Ceramic; Min Operating Temperature: -55°C; Max Operating Temperature: 85°C; Package Quantity: 15000; Packaging: Tape and Reel; Capacitance: 100nF; Tolerance: 10%; Dielectric: X5R; Termination: SMD/SMT; Voltage Rating (DC): 25V; Series: C; Length: 0.6mm; Width: 0.3mm; Height: 0.3mm; Depth: 0.3mm; Reach SVHC Compliant: No; Lead Free: Lead Free; RoHS Compliant: Yes; ComponentLink1URL: https://datasheet.ciiva.com/14915/tdkmlcccaprange-14915358.pdf?src-supplier=Digi-Key; ComponentLink1Description: https://datasheet.ciiva.com/14915/tdkmlcccaprange-14915358.pdf?src-supplier=Digi-Key; Supplier Part Number 1: 445-13671-1-ND
R?#3 = RES_10K-0.05W-1%-0201: 10 kOhms ±1% 0.05W, 1/20W Chip Resistor 0201 (0603 Metric) Thick Film /; Manufacturer: Stackpole Electronics Inc; Manufacturer Part Number: RMCF0201FT10K0; Case/Package: 0201; Supplier-1: Digikey
U?#7 = IC_KLMAG2WEMB-B031: 16GB NAND Flash Memory; Manufacturer: Samsung Electronics; Manufacturer Part Number: KLMAG2WEMB-B031; Case/Package: 153-FBGA; Supplier-1: NA

## Sheet PowerPins_RK3399.SchDoc
size A3; SheetNumber: 6; SheetTotal: 7
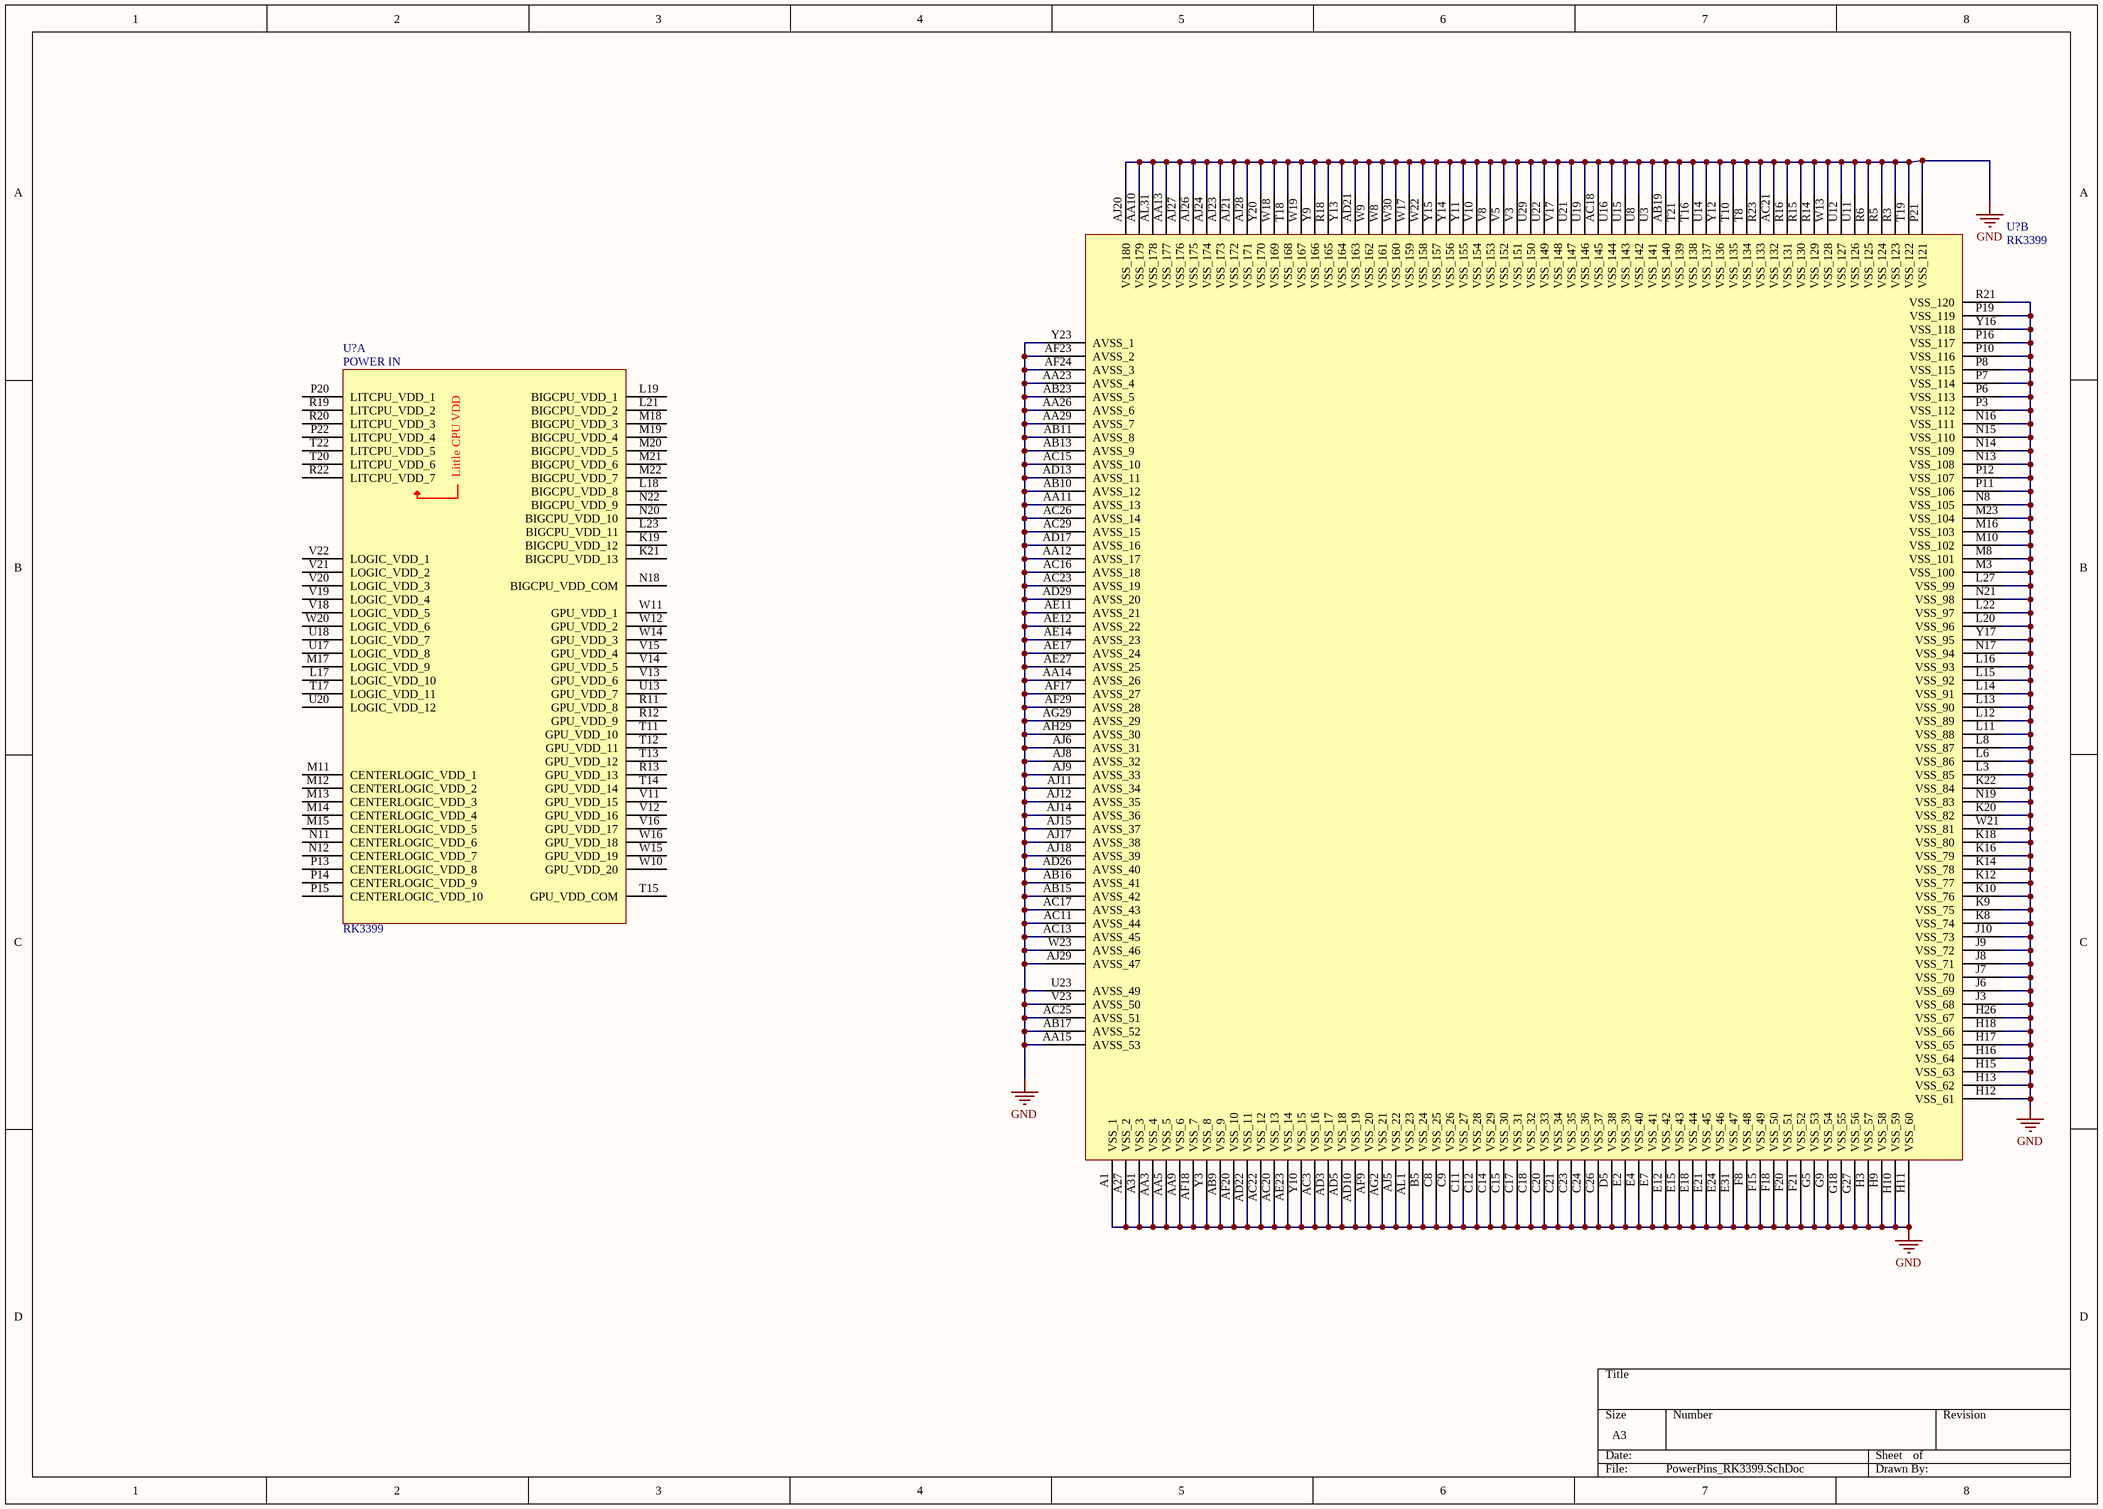
[diagram p5: PowerPins_RK3399.SchDoc]

### Parts
(Parts that share a designator on the sheet are numbered #1, #2 ... from top to bottom, then left to right.)
U?#8  RK3399  [BGA828_RK3399]  (part B of 24)
U?#9  RK3399  [BGA828_RK3399]  (part A of 24)

### Nets
GND: U?#8.A1(VSS_1) U?#8.A27(VSS_2) U?#8.A31(VSS_3) U?#8.AA3(VSS_4) U?#8.AA5(VSS_5) U?#8.AA9(VSS_6) U?#8.AA10(VSS_179) U?#8.AA11(AVSS_13) U?#8.AA12(AVSS_17) U?#8.AA13(VSS_177) U?#8.AA14(AVSS_26) U?#8.AA15(AVSS_53) U?#8.AA23(AVSS_4) U?#8.AA26(AVSS_6) U?#8.AA29(AVSS_7) U?#8.AB9(VSS_9) U?#8.AB10(AVSS_12) U?#8.AB11(AVSS_8) U?#8.AB13(AVSS_9) U?#8.AB15(AVSS_42) U?#8.AB16(AVSS_41) U?#8.AB17(AVSS_52) U?#8.AB19(VSS_140) U?#8.AB23(AVSS_5) U?#8.AC3(VSS_16) U?#8.AC11(AVSS_44) U?#8.AC13(AVSS_45) U?#8.AC15(AVSS_10) U?#8.AC16(AVSS_18) U?#8.AC17(AVSS_43) U?#8.AC18(VSS_145) U?#8.AC20(VSS_13) U?#8.AC21(VSS_132) U?#8.AC22(VSS_12) U?#8.AC23(AVSS_19) U?#8.AC25(AVSS_51) U?#8.AC26(AVSS_14) U?#8.AC29(AVSS_15) U?#8.AD3(VSS_17) U?#8.AD5(VSS_18) U?#8.AD10(VSS_19) U?#8.AD13(AVSS_11) U?#8.AD17(AVSS_16) U?#8.AD21(VSS_163) U?#8.AD22(VSS_11) U?#8.AD26(AVSS_40) U?#8.AD29(AVSS_20) U?#8.AE11(AVSS_21) U?#8.AE12(AVSS_22) U?#8.AE14(AVSS_23) U?#8.AE17(AVSS_24) U?#8.AE23(VSS_14) U?#8.AE27(AVSS_25) U?#8.AF9(VSS_20) U?#8.AF17(AVSS_27) U?#8.AF18(VSS_7) U?#8.AF20(VSS_10) U?#8.AF23(AVSS_2) U?#8.AF24(AVSS_3) U?#8.AF29(AVSS_28) U?#8.AG2(VSS_21) U?#8.AG29(AVSS_29) U?#8.AH29(AVSS_30) U?#8.AJ5(VSS_22) U?#8.AJ6(AVSS_31) U?#8.AJ8(AVSS_32) U?#8.AJ9(AVSS_33) U?#8.AJ11(AVSS_34) U?#8.AJ12(AVSS_35) U?#8.AJ14(AVSS_36) U?#8.AJ15(AVSS_37) U?#8.AJ17(AVSS_38) U?#8.AJ18(AVSS_39) U?#8.AJ20(VSS_180) U?#8.AJ21(VSS_172) U?#8.AJ23(VSS_173) U?#8.AJ24(VSS_174) U?#8.AJ26(VSS_175) U?#8.AJ27(VSS_176) U?#8.AJ28(VSS_171) U?#8.AJ29(AVSS_47) U?#8.AL1(VSS_23) U?#8.AL31(VSS_178) U?#8.B5(VSS_24) U?#8.C8(VSS_25) U?#8.C9(VSS_26) U?#8.C11(VSS_27) U?#8.C12(VSS_28) U?#8.C14(VSS_29) U?#8.C15(VSS_30) U?#8.C17(VSS_31) U?#8.C18(VSS_32) U?#8.C20(VSS_33) U?#8.C21(VSS_34) U?#8.C23(VSS_35) U?#8.C24(VSS_36) U?#8.C26(VSS_37) U?#8.D5(VSS_38) U?#8.E2(VSS_39) U?#8.E4(VSS_40) U?#8.E7(VSS_41) U?#8.E12(VSS_42) U?#8.E15(VSS_43) U?#8.E18(VSS_44) U?#8.E21(VSS_45) U?#8.E24(VSS_46) U?#8.E31(VSS_47) U?#8.F8(VSS_48) U?#8.F15(VSS_49) U?#8.F18(VSS_50) U?#8.F20(VSS_51) U?#8.F21(VSS_52) U?#8.G5(VSS_53) U?#8.G9(VSS_54) U?#8.G18(VSS_55) U?#8.G27(VSS_56) U?#8.H3(VSS_57) U?#8.H9(VSS_58) U?#8.H10(VSS_59) U?#8.H11(VSS_60) U?#8.H12(VSS_61) U?#8.H13(VSS_62) U?#8.H15(VSS_63) U?#8.H16(VSS_64) U?#8.H17(VSS_65) U?#8.H18(VSS_66) U?#8.H26(VSS_67) U?#8.J3(VSS_68) U?#8.J6(VSS_69) U?#8.J7(VSS_70) U?#8.J8(VSS_71) U?#8.J9(VSS_72) U?#8.J10(VSS_73) U?#8.K8(VSS_74) U?#8.K9(VSS_75) U?#8.K10(VSS_76) U?#8.K12(VSS_77) U?#8.K14(VSS_78) U?#8.K16(VSS_79) U?#8.K18(VSS_80) U?#8.K20(VSS_82) U?#8.K22(VSS_84) U?#8.L3(VSS_85) U?#8.L6(VSS_86) U?#8.L8(VSS_87) U?#8.L11(VSS_88) U?#8.L12(VSS_89) U?#8.L13(VSS_90) U?#8.L14(VSS_91) U?#8.L15(VSS_92) U?#8.L16(VSS_93) U?#8.L20(VSS_96) U?#8.L22(VSS_97) U?#8.L27(VSS_99) U?#8.M3(VSS_100) U?#8.M8(VSS_101) U?#8.M10(VSS_102) U?#8.M16(VSS_103) U?#8.M23(VSS_104) U?#8.N8(VSS_105) U?#8.N13(VSS_108) U?#8.N14(VSS_109) U?#8.N15(VSS_110) U?#8.N16(VSS_111) U?#8.N17(VSS_94) U?#8.N19(VSS_83) U?#8.N21(VSS_98) U?#8.P3(VSS_112) U?#8.P6(VSS_113) U?#8.P7(VSS_114) U?#8.P8(VSS_115) U?#8.P10(VSS_116) U?#8.P11(VSS_106) U?#8.P12(VSS_107) U?#8.P16(VSS_117) U?#8.P19(VSS_119) U?#8.P21(VSS_121) U?#8.R3(VSS_123) U?#8.R5(VSS_124) U?#8.R6(VSS_125) U?#8.R14(VSS_129) U?#8.R15(VSS_130) U?#8.R16(VSS_131) U?#8.R18(VSS_165) U?#8.R21(VSS_120) U?#8.R23(VSS_133) U?#8.T8(VSS_134) U?#8.T10(VSS_135) U?#8.T16(VSS_138) U?#8.T18(VSS_168) U?#8.T19(VSS_122) U?#8.T21(VSS_139) U?#8.U3(VSS_141) U?#8.U8(VSS_142) U?#8.U11(VSS_126) U?#8.U12(VSS_127) U?#8.U14(VSS_137) U?#8.U15(VSS_143) U?#8.U16(VSS_144) U?#8.U19(VSS_146) U?#8.U21(VSS_147) U?#8.U22(VSS_149) U?#8.U23(AVSS_49) U?#8.U29(VSS_150) U?#8.V3(VSS_151) U?#8.V5(VSS_152) U?#8.V8(VSS_153) U?#8.V10(VSS_154) U?#8.V17(VSS_148) U?#8.V23(AVSS_50) U?#8.W8(VSS_161) U?#8.W9(VSS_162) U?#8.W13(VSS_128) U?#8.W17(VSS_159) U?#8.W18(VSS_169) U?#8.W19(VSS_167) U?#8.W21(VSS_81) U?#8.W22(VSS_158) U?#8.W23(AVSS_46) U?#8.W30(VSS_160) U?#8.Y3(VSS_8) U?#8.Y9(VSS_166) U?#8.Y10(VSS_15) U?#8.Y11(VSS_155) U?#8.Y12(VSS_136) U?#8.Y13(VSS_164) U?#8.Y14(VSS_156) U?#8.Y15(VSS_157) U?#8.Y16(VSS_118) U?#8.Y17(VSS_95) U?#8.Y20(VSS_170) U?#8.Y23(AVSS_1)

Not connected (* = marked no-connect by the designer): U?#9 K19(BIGCPU_VDD_12) K21(BIGCPU_VDD_13) L17(LOGIC_VDD_10) L18(BIGCPU_VDD_8) L19(BIGCPU_VDD_1) L21(BIGCPU_VDD_2) L23(BIGCPU_VDD_11) M11(CENTERLOGIC_VDD_1) M12(CENTERLOGIC_VDD_2) M13(CENTERLOGIC_VDD_3) M14(CENTERLOGIC_VDD_4) M15(CENTERLOGIC_VDD_5) M17(LOGIC_VDD_9) M18(BIGCPU_VDD_3) M19(BIGCPU_VDD_4) M20(BIGCPU_VDD_5) M21(BIGCPU_VDD_6) M22(BIGCPU_VDD_7) N11(CENTERLOGIC_VDD_6) N12(CENTERLOGIC_VDD_7) N18(BIGCPU_VDD_COM) N20(BIGCPU_VDD_10) N22(BIGCPU_VDD_9) P13(CENTERLOGIC_VDD_8) P14(CENTERLOGIC_VDD_9) P15(CENTERLOGIC_VDD_10) P20(LITCPU_VDD_1) P22(LITCPU_VDD_4) R11(GPU_VDD_8) R12(GPU_VDD_9) R13(GPU_VDD_13) R19(LITCPU_VDD_2) R20(LITCPU_VDD_3) R22(LITCPU_VDD_7) T11(GPU_VDD_10) T12(GPU_VDD_11) T13(GPU_VDD_12) T14(GPU_VDD_14) T15(GPU_VDD_COM) T17(LOGIC_VDD_11) T20(LITCPU_VDD_6) T22(LITCPU_VDD_5) U13(GPU_VDD_7) U17(LOGIC_VDD_8) U18(LOGIC_VDD_7) U20(LOGIC_VDD_12) V11(GPU_VDD_15) V12(GPU_VDD_16) V13(GPU_VDD_6) V14(GPU_VDD_5) V15(GPU_VDD_4) V16(GPU_VDD_17) V18(LOGIC_VDD_5) V19(LOGIC_VDD_4) V20(LOGIC_VDD_3) V21(LOGIC_VDD_2) V22(LOGIC_VDD_1) W10(GPU_VDD_20) W11(GPU_VDD_1) W12(GPU_VDD_2) W14(GPU_VDD_3) W15(GPU_VDD_19) W16(GPU_VDD_18) W20(LOGIC_VDD_6)

### Notes on the sheet
- (in symbol IC_RK3399-FCBGA828, part A) POWER IN; Little CPU VDD

### Library data of the parts
U?#8 U?#9 = IC_RK3399-FCBGA828: as U?#1 on sheet RK3399_LPDDR4_Pins; Manufacturer Part Number: RK3399; Case/Package: FCBGA828; Supplier-1: Rockchip

## Sheet PMIC_RK808.SchDoc
size A3; SheetNumber: 7; SheetTotal: 7
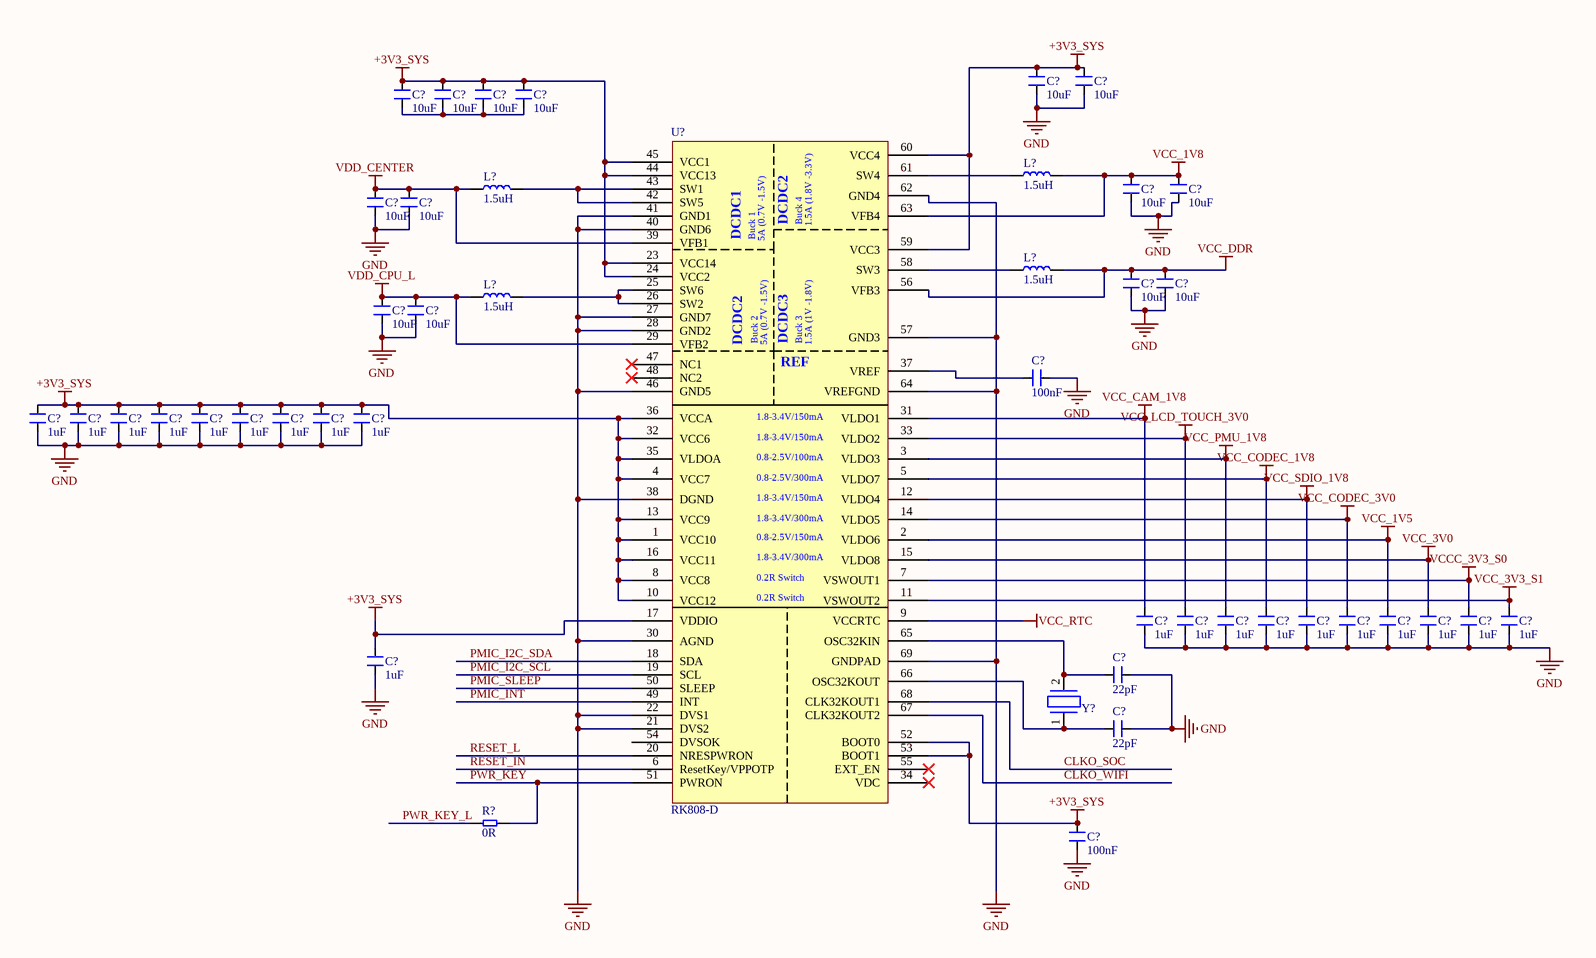
[diagram p6: PMIC_RK808.SchDoc]

### Parts
(Parts that share a designator on the sheet are numbered #1, #2 ... from top to bottom, then left to right.)
C?#12  10uF  [CAP_0402]
C?#13  10uF  [CAP_0402]
C?#14  10uF  [CAP_0402]
C?#15  10uF  [CAP_0402]
C?#16  10uF  [CAP_0402]
C?#17  10uF  [CAP_0402]
C?#18  10uF  [CAP_0402]
C?#19  10uF  [CAP_0402]
C?#20  10uF  [CAP_0402]
C?#21  10uF  [CAP_0402]
C?#22  10uF  [CAP_0402]
C?#23  10uF  [CAP_0402]
C?#24  10uF  [CAP_0402]
C?#25  10uF  [CAP_0402]
C?#26  100nF  [CAP_0201]
C?#27  1uF  [CAP_0201]
C?#28  1uF  [CAP_0201]
C?#29  1uF  [CAP_0201]
C?#30  1uF  [CAP_0201]
C?#31  1uF  [CAP_0201]
C?#32  1uF  [CAP_0201]
C?#33  1uF  [CAP_0201]
C?#34  1uF  [CAP_0201]
C?#35  1uF  [CAP_0201]
C?#36  1uF  [CAP_0201]
C?#37  1uF  [CAP_0201]
C?#38  1uF  [CAP_0201]
C?#39  1uF  [CAP_0201]
C?#40  1uF  [CAP_0201]
C?#41  1uF  [CAP_0201]
C?#42  1uF  [CAP_0201]
C?#43  1uF  [CAP_0201]
C?#44  1uF  [CAP_0201]
C?#45  1uF  [CAP_0201]
C?#46  1uF  [CAP_0201]
C?#47  22pF  [CAP_0201]
C?#48  22pF  [CAP_0201]
C?#49  100nF  [CAP_0201]
L?#1  1.5uH
L?#2  1.5uH
L?#3  1.5uH
L?#4  1.5uH
R?#4  0R  [RES_0201]
U?#10  RK808-D  [QFN68_13.7_220.4X220.4_SMD]
Y?#1  32KHz  (value not drawn)

### Nets
+3V3_SYS: C?#12.2 C?#13.2 C?#14.2 C?#15.2 C?#16.2 C?#17.2 C?#27.2 C?#28.2 C?#29.2 C?#30.2 C?#31.2 C?#32.2 C?#33.2 C?#34.2 C?#35.2 C?#46.2 C?#49.2 U?#10.1(VCC10) U?#10.4(VCC7) U?#10.8(VCC8) U?#10.10(VCC12) U?#10.13(VCC9) U?#10.16(VCC11) U?#10.17(VDDIO) U?#10.23(VCC14) U?#10.24(VCC2) U?#10.32(VCC6) U?#10.35(VLDOA) U?#10.36(VCCA) U?#10.44(VCC13) U?#10.45(VCC1) U?#10.52(BOOT0) U?#10.53(BOOT1) U?#10.59(VCC3) U?#10.60(VCC4)
GND: C?#12.1 C?#13.1 C?#18.1 C?#19.1 C?#20.1 C?#21.1 C?#22.1 C?#23.1 C?#24.1 C?#25.1 C?#26.1 C?#27.1 C?#28.1 C?#29.1 C?#30.1 C?#31.1 C?#32.1 C?#33.1 C?#34.1 C?#35.1 C?#36.1 C?#37.1 C?#38.1 C?#39.1 C?#40.1 C?#41.1 C?#42.1 C?#43.1 C?#44.1 C?#45.1 C?#46.1 C?#47.1 C?#48.1 C?#49.1 U?#10.21(DVS2) U?#10.22(DVS1) U?#10.27(GND7) U?#10.28(GND2) U?#10.30(AGND) U?#10.38(DGND) U?#10.40(GND6) U?#10.41(GND1) U?#10.46(GND5) U?#10.57(GND3) U?#10.62(GND4) U?#10.64(VREFGND) U?#10.69(GNDPAD)
VCC_1V5: C?#42.2 U?#10.2(VLDO6)
VCC_1V8: C?#18.2 C?#19.2 L?#1.2 U?#10.63(VFB4)
VCC_3V0: C?#43.2 U?#10.15(VLDO8)
VCC_3V3_S1: C?#45.2 U?#10.11(VSWOUT2)
VCC_CAM_1V8: C?#36.2 U?#10.31(VLDO1)
VCC_CODEC_1V8: C?#39.2 U?#10.5(VLDO7)
VCC_CODEC_3V0: C?#41.2 U?#10.14(VLDO5)
VCC_DDR: C?#22.2 C?#23.2 L?#3.2 U?#10.56(VFB3)
VCC_LCD_TOUCH_3V0: C?#37.2 U?#10.33(VLDO2)
VCC_PMU_1V8: C?#38.2 U?#10.3(VLDO3)
VCC_RTC: U?#10.9(VCCRTC)
VCC_SDIO_1V8: C?#40.2 U?#10.12(VLDO4)
VCCC_3V3_S0: C?#44.2 U?#10.7(VSWOUT1)
VDD_CENTER: C?#20.2 C?#21.2 L?#2.1 U?#10.39(VFB1)
VDD_CPU_L: C?#24.2 C?#25.2 L?#4.1 U?#10.29(VFB2)
CLKO_SOC: U?#10.68(CLK32KOUT1)
CLKO_WIFI: U?#10.67(CLK32KOUT2)
PMIC_I2C_SCL: U?#10.19(SCL)
PMIC_I2C_SDA: U?#10.18(SDA)
PMIC_INT: U?#10.49(INT)
PMIC_SLEEP: U?#10.50(SLEEP)
PWR_KEY: R?#4.2 U?#10.51(PWRON)
PWR_KEY_L: R?#4.1
RESET_IN: U?#10.6(ResetKey/VPPOTP)
RESET_L: U?#10.20(NRESPWRON)
NetC?#14_1: C?#14.1 C?#15.1 C?#16.1 C?#17.1
NetC?#26_2: C?#26.2 U?#10.37(VREF)
NetC?#47_2: C?#47.2 U?#10.65(OSC32KIN) Y?#1.2
NetC?#48_2: C?#48.2 U?#10.66(OSC32KOUT) Y?#1.1
NetL?#1_1: L?#1.1 U?#10.61(SW4)
NetL?#2_2: L?#2.2 U?#10.42(SW5) U?#10.43(SW1)
NetL?#3_1: L?#3.1 U?#10.58(SW3)
NetL?#4_2: L?#4.2 U?#10.25(SW6) U?#10.26(SW2)

Not connected (* = marked no-connect by the designer): U?#10 34(VDC)* 47(NC1)* 48(NC2)* 54(DVSOK) 55(EXT_EN)*

### Notes on the sheet
- (in symbol IC_RK808-D-QFN68) DCDC2; Buck 4; 1.5A (1.8V -3.3V); DCDC1; Buck 1; 5A (0.7V -1.5V); Buck 2; DCDC3; Buck 3; 1.5A (1V -1.8V); REF; 1.8-3.4V/150mA; 0.8-2.5V/100mA; 0.8-2.5V/300mA; 1.8-3.4V/300mA; 0.8-2.5V/150mA; 0.2R Switch

### Library data of the parts
C?#12-C?#25 = CAP_10uF-10V-20%-0402: Multilayer Ceramic Capacitor, 10 uF, 10 V, ± 20%, X5R, 0402 [1005 Metric]; Manufacturer Part Number: CL05A106MP5NUNC; Manufacturer: Samsung Electro-Mechanics; Manufacturer 1: Samsung; Voltage Rating: 10V; Case/Package: 0402; Supplier-1: Digikey; Supplier 1: Digi-Key; Manufacturer Part Number 1: CL05A106MP5NUNC; RoHS: Yes; Category: Ceramic Capacitors; Stock 1: 2175928; Pricing 1: 1=0.18, 10=0.121, 50=0.0726, 100=0.0613, 500=0.04192, 1000=0.03708, 2500=0.03546, 5000=0.03224 (USD); Mount: Surface Mount; Case Code (Metric): 1005; Case Code (Imperial): 0402; Min Operating Temperature: -55°C; Max Operating Temperature: 85°C; Package Quantity: 1; Packaging: Tape and Reel; Capacitance: 10uF; Tolerance: 20%; Dielectric: X5R; Series: CL; Length: 1mm; Width: 0.02inch; Thickness: 0.028inch; Depth: 0.5mm; Radiation Hardening: No; Lead Free: Lead Free; RoHS Compliant: Yes; ComponentLink1URL: https://datasheet.ciiva.com/25721/cl05a106mp5nunc-25721584.pdf?src-supplier=Digi-Key; ComponentLink1Description: https://datasheet.ciiva.com/25721/cl05a106mp5nunc-25721584.pdf?src-supplier=Digi-Key; ComponentLink2URL: https://datasheet.ciiva.com/26838/getdatasheetpartid-745310-26838170.pdf?src-supplier=Verical; ComponentLink2Description: https://datasheet.ciiva.com/26838/getdatasheetpartid-745310-26838170.pdf?src-supplier=Verical; Supplier Part Number 1: 1276-1450-1-ND
C?#26 C?#49 = CAP_100nF-25V-10%-0201: as C?#1 on sheet EMMC_RK3399; Case/Package: 0201; Supplier-1: Digikey; Supplier 1: Digi-Key; Manufacturer Part Number 1: C0603X5R1E104K030BB; RoHS: Yes; Category: Ceramic Capacitors; Stock 1: 525939; Pricing 1: 1=0.1, 10=0.069, 50=0.0376, 100=0.0307, 500=0.02192, 1000=0.01722, 2500=0.01566, 5000=0.0144 (USD); Mount: Surface Mount; Case Code (Metric): 0603; Case Code (Imperial): 0201; Weight: 6E-06oz; Dielectric Material: Ceramic; Min Operating Temperature: -55°C; Max Operating Temperature: 85°C; Package Quantity: 15000; Packaging: Tape and Reel; Capacitance: 100nF; Tolerance: 10%; Dielectric: X5R; Termination: SMD/SMT; Voltage Rating (DC): 25V; Series: C; Length: 0.6mm; Width: 0.3mm; Height: 0.3mm; Depth: 0.3mm; Reach SVHC Compliant: No; Lead Free: Lead Free; RoHS Compliant: Yes; ComponentLink1URL: https://datasheet.ciiva.com/14915/tdkmlcccaprange-14915358.pdf?src-supplier=Digi-Key; ComponentLink1Description: https://datasheet.ciiva.com/14915/tdkmlcccaprange-14915358.pdf?src-supplier=Digi-Key; Supplier Part Number 1: 445-13671-1-ND
C?#27-C?#46 = CAP_1uF-16V-10%-0201: Multilayer Ceramic Capacitor, 1 uF, 16 V, ± 20%, X5R, 0201 [0603 Metric]; Manufacturer: Samsung Electro-Mechanics; Manufacturer Part Number: CL03A105MO3NRNH; Manufacturer 1: Samsung; Case/Package: 0201; Supplier-1: Digikey; Supplier 1: Digi-Key; Manufacturer Part Number 1: CL03A105MO3NRNH; RoHS: Yes; Category: Ceramic Capacitors; Stock 1: 1186098; Pricing 1: 1=0.25, 10=0.17, 50=0.1018, 100=0.086, 500=0.05882, 1000=0.05204, 2500=0.04977, 5000=0.04525 (USD); ComponentLink1URL: https://datasheet.octopart.com/CL03A105MO3NRNH-Samsung-Electro-Mechanics-datasheet-136037157.pdf?src-supplier=Future+Electronics; ComponentLink1Description: https://datasheet.octopart.com/CL03A105MO3NRNH-Samsung-Electro-Mechanics-datasheet-136037157.pdf?src-supplier=Future+Electronics; ComponentLink2URL: http://www.samsungsem.com/kr/support/product-search/mlcc/CL03A105MO3NRNH.jsp?src-supplier=Digi-Key; ComponentLink2Description: http://www.samsungsem.com/kr/support/product-search/mlcc/CL03A105MO3NRNH.jsp?src-supplier=Digi-Key
C?#47 C?#48 = CAP_22pF-25V-10%-0201: Cap Ceramic 22pF 25V C0G 10% SMD 0201 125C Paper T/R; Manufacturer: Johanson Technology Inc.; Manufacturer Part Number: 250R05L220KV4T; Manufacturer 1: Johanson; Case/Package: 0201; Supplier-1: Digikey; Supplier 1: Mouser; Manufacturer Part Number 1: 250R05L220KV4T; RoHS: Yes; Category: Ceramic Capacitors; Pricing 1: 1=0.11, 10=0.081, 50=0.081, 100=0.037, 1000=0.021, 10000=0.015 (USD); Mount: Surface Mount; Case Code (Imperial): 0201; Case Code (Metric): 0603; Weight: 6E-06oz; Min Operating Temperature: -55°C; Max Operating Temperature: 125°C; Voltage Rating: 25V; Capacitance: 22pF; Voltage Rating (DC): 25V; Tolerance: 10%; Packaging: Tape and Reel; Package Quantity: 15000; Dielectric: C0G; Termination: SMD/SMT; Series: L; Length: 0.6mm; Width: 0.3mm; Height: 0.3mm; Depth: 0.3mm; RoHS Compliant: Yes; ComponentLink1URL: http://www.mouser.com/ds/2/611/JTI-CAT-MLCC-HighQ-516212.pdf?src-supplier=Mouser; ComponentLink1Description: http://www.mouser.com/ds/2/611/JTI-CAT-MLCC-HighQ-516212.pdf?src-supplier=Mouser; ComponentLink2URL: https://www.johansontechnology.com/downloads/JTI-CAT-MLCC-HighQ.pdf?src-supplier=Digi-Key; ComponentLink2Description: https://www.johansontechnology.com/downloads/JTI-CAT-MLCC-HighQ.pdf?src-supplier=Digi-Key; ComponentLink3URL: http://components.arrow.com/part/dataview/43745096S9156427N2069?src-supplier=Arrow+Electronics; ComponentLink3Description: http://components.arrow.com/part/dataview/43745096S9156427N2069?src-supplier=Arrow+Electronics; Supplier Part Number 1: 609-250R05L220KV4T
L?#1-L?#4 = IND_1.5uH-6A-20%-SMD: WPN4020H1R5MT / Wire Wound SMD Power Inductors – WPN Series / Operating Temp. : -40℃~+125℃ (Including self-heating) /; Manufacturer: Sunlord; Mnaufcaturer Part Number: WPN4020H1R5MT; Case/Package: SMD; Supplier-1: NA
R?#4 = RES_0R-0.05W-1%-0201: 0 Ohms Jumper 0.05W, 1/20W Chip Resistor 0201 (0603 Metric) Automotive AEC-Q200 Thick Film; Manufacturer: Bourns Inc.; Manufacturer Part Number: CR0201AJ/-000GLF; Case/Package: 0201; Supplier-1: Digikey
U?#10 = IC_RK808-D-QFN68: The RK808 is a complete power supply solution for Portable systems.; Manufacturer: Rockchip; Manufacturer Part Number: RK808-D; Case/Package: QFN68; Supplier-1: Rockchip
Y?#1 = XTAL_32MHz_ABS07-32.768KHZ-T: Crystal 0.032768MHz ±20ppm (Tol) 12.5pF Flexural 70000Ohm 2-Pin CSMD T/R; Manufacturer: Abracon; ESR (Equivalent Series Resistance): 70kR; Supplier 1: Future Electronics; Manufacturer Part Number: ABS07-32.768KHZ-T; RoHS: Yes; Category: Crystals; Stock 1: 461; Pricing 1: 1=0.675, 15=0.585, 75=0.53, 300=0.48, 1500=0.425 (USD); Case/Package: CSMD; Number of Pins: 2; Min Operating Temperature: -40°C; Max Operating Temperature: 85°C; Frequency Tolerance: 20ppm; Load Capacitance: 12.5pF; Frequency: 32.768kHz; Packaging: Tape and Reel; Series: ABS07; Operating Frequency: 32.768 kHz; Package Quantity: 3000; Tolerance: 20ppm; Termination: SMD/SMT; Series Resistance: 70kR; Length: 3.2mm; Width: 1.5mm; Height: 0.9mm; Depth: 1.5mm; Radiation Hardening: No; Lead Free: Lead Free; RoHS Compliant: Yes; Reach SVHC Compliant: No; ComponentLink1URL: https://datasheet.ciiva.com/7998/1912628-7998667.pdf?src-supplier=Element14; ComponentLink1Description: https://datasheet.ciiva.com/7998/1912628-7998667.pdf?src-supplier=Element14; ComponentLink2URL: https://datasheet.ciiva.com/1357/1883680-1357319.pdf?src-supplier=Element14; ComponentLink2Description: https://datasheet.ciiva.com/1357/1883680-1357319.pdf?src-supplier=Element14; ComponentLink3URL: https://datasheet.ciiva.com/854/abs07-854936.pdf?src-supplier=Digi-Key; ComponentLink3Description: https://datasheet.ciiva.com/854/abs07-854936.pdf?src-supplier=Digi-Key; ComponentLink4URL: https://datasheet.ciiva.com/854/abs07-854935.pdf?src-supplier=Digi-Key; ComponentLink4Description: https://datasheet.ciiva.com/854/abs07-854935.pdf?src-supplier=Digi-Key; ComponentLink5URL: https://datasheet.ciiva.com/854/abs07-854937.pdf?src-supplier=Digi-Key; ComponentLink5Description: https://datasheet.ciiva.com/854/abs07-854937.pdf?src-supplier=Digi-Key; ComponentLink6URL: https://datasheet.ciiva.com/4944/abs07-11028-4944830.pdf?src-supplier=Mouser; ComponentLink6Description: https://datasheet.ciiva.com/4944/abs07-11028-4944830.pdf?src-supplier=Mouser; ComponentLink7URL: https://datasheet.ciiva.com/15214/getdatasheetpartid-727011-15214954.pdf?src-supplier=Verical; ComponentLink7Description: https://datasheet.ciiva.com/15214/getdatasheetpartid-727011-15214954.pdf?src-supplier=Verical

## Sheet EMMC-SDMMC-PCIe-ADC.SchDoc
size A3; SheetNumber: 8; SheetTotal: 9
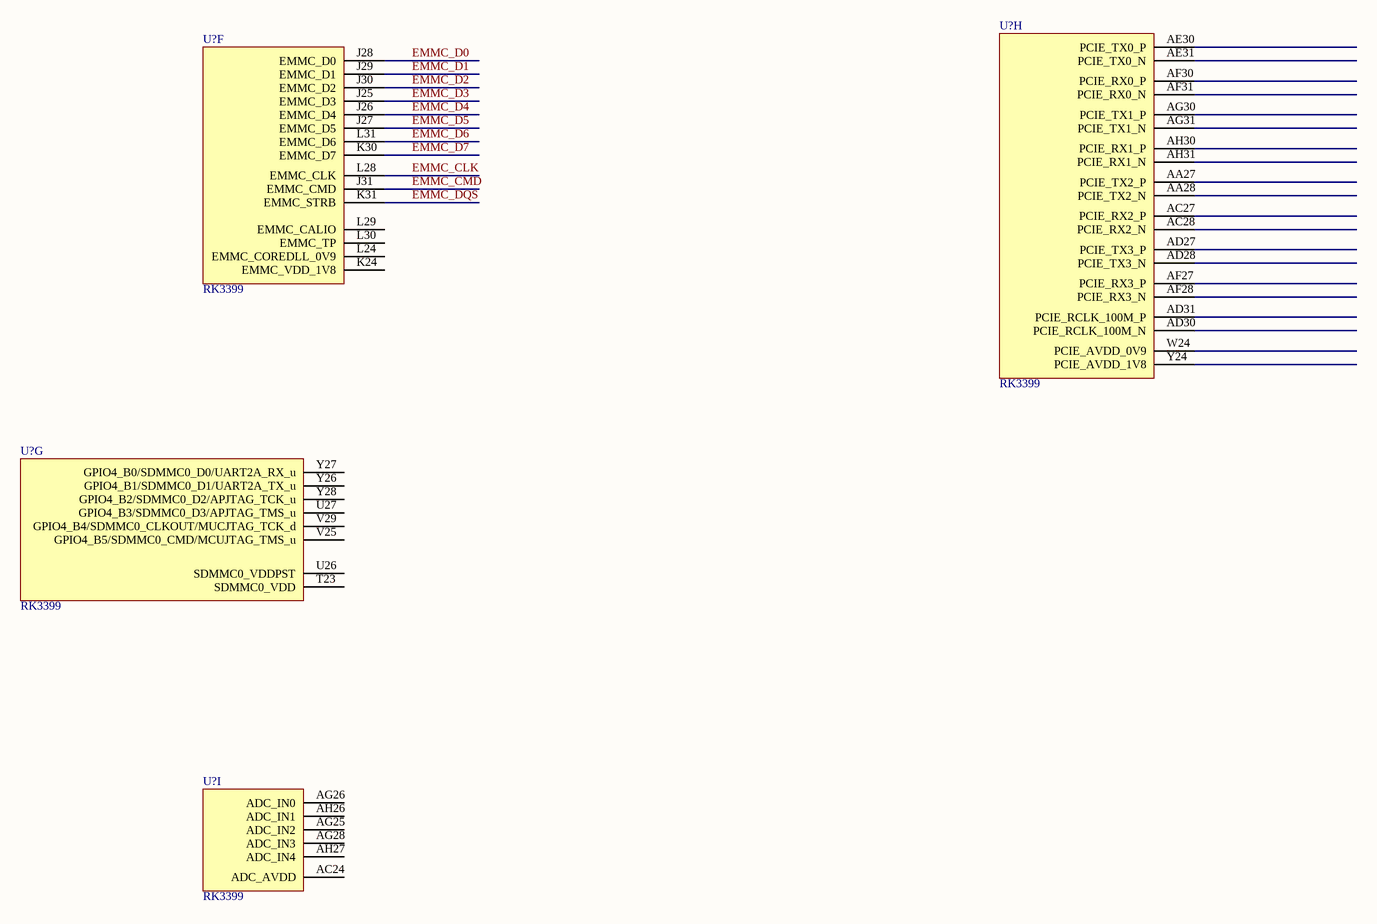
[diagram p7: EMMC-SDMMC-PCIe-ADC.SchDoc]

### Parts
(Parts that share a designator on the sheet are numbered #1, #2 ... from top to bottom, then left to right.)
U?#11  RK3399  [BGA828_RK3399]  (part H of 24)
U?#12  RK3399  [BGA828_RK3399]  (part F of 24)
U?#13  RK3399  [BGA828_RK3399]  (part G of 24)
U?#14  RK3399  [BGA828_RK3399]  (part I of 24)

### Nets
EMMC_CLK: U?#12.L28(EMMC_CLK)
EMMC_CMD: U?#12.J31(EMMC_CMD)
EMMC_D0: U?#12.J28(EMMC_D0)
EMMC_D1: U?#12.J29(EMMC_D1)
EMMC_D2: U?#12.J30(EMMC_D2)
EMMC_D3: U?#12.J25(EMMC_D3)
EMMC_D4: U?#12.J26(EMMC_D4)
EMMC_D5: U?#12.J27(EMMC_D5)
EMMC_D6: U?#12.L31(EMMC_D6)
EMMC_D7: U?#12.K30(EMMC_D7)
EMMC_DQS: U?#12.K31(EMMC_STRB)

Not connected (* = marked no-connect by the designer): U?#11 AA27(PCIE_TX2_P) AA28(PCIE_TX2_N) AC27(PCIE_RX2_P) AC28(PCIE_RX2_N) AD27(PCIE_TX3_P) AD28(PCIE_TX3_N) AD30(PCIE_RCLK_100M_N) AD31(PCIE_RCLK_100M_P) AE30(PCIE_TX0_P) AE31(PCIE_TX0_N) AF27(PCIE_RX3_P) AF28(PCIE_RX3_N) AF30(PCIE_RX0_P) AF31(PCIE_RX0_N) AG30(PCIE_TX1_P) AG31(PCIE_TX1_N) AH30(PCIE_RX1_P) AH31(PCIE_RX1_N) W24(PCIE_AVDD_0V9) Y24(PCIE_AVDD_1V8); U?#12 K24(EMMC_VDD_1V8) L24(EMMC_COREDLL_0V9) L29(EMMC_CALIO) L30(EMMC_TP); U?#13 T23(SDMMC0_VDD) U26(SDMMC0_VDDPST) U27(GPIO4_B3/SDMMC0_D3/APJTAG_TMS_u) V25(GPIO4_B5/SDMMC0_CMD/MCUJTAG_TMS_u) V29(GPIO4_B4/SDMMC0_CLKOUT/MUCJTAG_TCK_d) Y26(GPIO4_B1/SDMMC0_D1/UART2A_TX_u) Y27(GPIO4_B0/SDMMC0_D0/UART2A_RX_u) Y28(GPIO4_B2/SDMMC0_D2/APJTAG_TCK_u); U?#14 AC24(ADC_AVDD) AG25(ADC_IN2) AG26(ADC_IN0) AG28(ADC_IN3) AH26(ADC_IN1) AH27(ADC_IN4)

### Library data of the parts
U?#11-U?#14 = IC_RK3399-FCBGA828: as U?#1 on sheet RK3399_LPDDR4_Pins; Manufacturer Part Number: RK3399; Case/Package: FCBGA828; Supplier-1: Rockchip

## Sheet System PMU pins.SchDoc
size A3; SheetNumber: 9; SheetTotal: 9
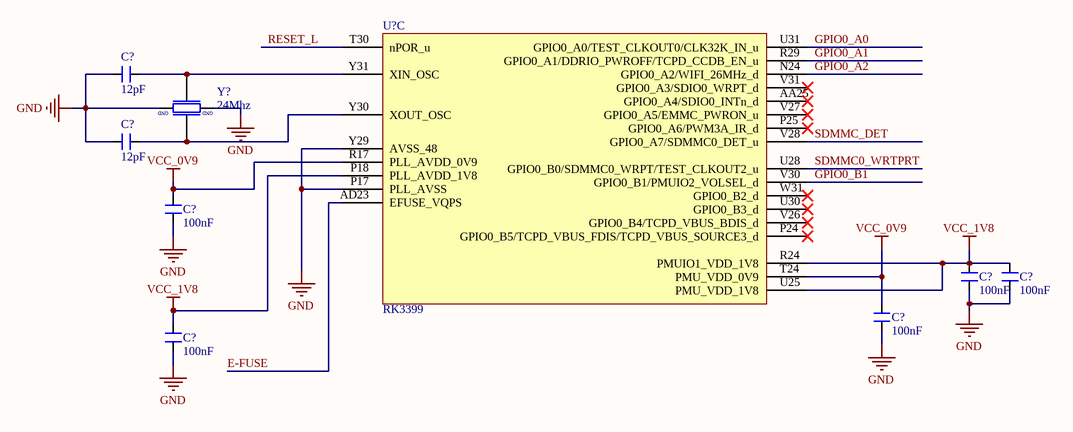
[diagram p8: System PMU pins.SchDoc]

### Parts
(Parts that share a designator on the sheet are numbered #1, #2 ... from top to bottom, then left to right.)
C?#50  12pF  [CAP_0201]
C?#51  12pF  [CAP_0201]
C?#52  100nF  [CAP_0201]
C?#53  100nF  [CAP_0201]
C?#54  100nF  [CAP_0201]
C?#55  100nF  [CAP_0201]
C?#56  100nF  [CAP_0201]
U?#15  RK3399  [BGA828_RK3399]  (part C of 24)
Y?#2  24Mhz  [XTAL_ABM8AIG-24.000MHZ-12-2Z-T3]

### Nets
GND: C?#50.2 C?#51.2 C?#52.1 C?#53.1 C?#54.1 C?#55.1 C?#56.1 U?#15.P17(PLL_AVSS) U?#15.Y29(AVSS_48) Y?#2.2 Y?#2.4
VCC_0V9: C?#52.2 C?#55.2 U?#15.R17(PLL_AVDD_0V9) U?#15.T24(PMU_VDD_0V9)
VCC_1V8: C?#53.2 C?#54.2 C?#56.2 U?#15.P18(PLL_AVDD_1V8) U?#15.R24(PMUIO1_VDD_1V8) U?#15.U25(PMU_VDD_1V8)
E-FUSE: U?#15.AD23(EFUSE_VQPS)
GPIO0_A0: U?#15.U31(GPIO0_A0/TEST_CLKOUT0/CLK32K_IN_u)
GPIO0_A1: U?#15.R29(GPIO0_A1/DDRIO_PWROFF/TCPD_CCDB_EN_u)
GPIO0_A2: U?#15.N24(GPIO0_A2/WIFI_26MHz_d)
GPIO0_B1: U?#15.V30(GPIO0_B1/PMUIO2_VOLSEL_d)
RESET_L: U?#15.T30(nPOR_u)
SDMMC0_WRTPRT: U?#15.U28(GPIO0_B0/SDMMC0_WRPT/TEST_CLKOUT2_u)
SDMMC_DET: U?#15.V28(GPIO0_A7/SDMMC0_DET_u)
NetC?#50_1: C?#50.1 U?#15.Y31(XIN_OSC) Y?#2.3
NetC?#51_1: C?#51.1 U?#15.Y30(XOUT_OSC) Y?#2.1

Not connected (* = marked no-connect by the designer): U?#15 AA25(GPIO0_A4/SDIO0_INTn_d)* P24(GPIO0_B5/TCPD_VBUS_FDIS/TCPD_VBUS_SOURCE3_d)* P25(GPIO0_A6/PWM3A_IR_d)* U30(GPIO0_B3_d)* V26(GPIO0_B4/TCPD_VBUS_BDIS_d)* V27(GPIO0_A5/EMMC_PWRON_u)* V31(GPIO0_A3/SDIO0_WRPT_d)* W31(GPIO0_B2_d)*

### Notes on the sheet
- (in symbol XTAL_24Mhz-12pF-4-SMD) GND

### Library data of the parts
C?#50 C?#51 = CAP_12pF-16V-10%-0201: Capacitor SMD Ceramic 0201 Case 16Vdc C0G (NP0) Dielectric 12pF ±10% ø7T/R"; Manufacturer: AVX Corporation; Manufacturer Part Number: 0201YA120KAT2A; Manufacturer 1: Kyocera AVX; Voltage Rating: 16V; Case/Package: 0201; Supplier-1: Digikey; Supplier 1: Digi-Key; Manufacturer Part Number 1: 0201YA120KAT2A; RoHS: Yes; Category: Ceramic Capacitors; Pricing 1: 15000=0.06696 (USD); Mount: Surface Mount; Number of Pins: 2; Case Code (Imperial): 0201; Case Code (Metric): 0603; Min Operating Temperature: -55°C; Max Operating Temperature: 125°C; Packaging: Tape and Reel; Capacitance: 12pF; Tolerance: 10%; Package Quantity: 15000; Voltage Rating (DC): 16V; Dielectric: C0G; Termination: SMD/SMT; Series: -; Construction: Flat; Length: 0.6mm; Width: 0.3mm; Depth: 0.3mm; Radiation Hardening: No; RoHS Compliant: Yes; ComponentLink1URL: https://datasheet.ciiva.com/13269/ccog-243403-13269830.pdf?src-supplier=Mouser; ComponentLink1Description: https://datasheet.ciiva.com/13269/ccog-243403-13269830.pdf?src-supplier=Mouser; ComponentLink2URL: https://datasheet.ciiva.com/208/ccog-208350.pdf?src-supplier=Digi-Key; ComponentLink2Description: https://datasheet.ciiva.com/208/ccog-208350.pdf?src-supplier=Digi-Key; Supplier Part Number 1: 0201YA120KAT2A-ND
C?#52-C?#56 = CAP_100nF-25V-10%-0201: as C?#1 on sheet EMMC_RK3399; Case/Package: 0201; Supplier-1: Digikey; Supplier 1: Digi-Key; Manufacturer Part Number 1: C0603X5R1E104K030BB; RoHS: Yes; Category: Ceramic Capacitors; Stock 1: 525939; Pricing 1: 1=0.1, 10=0.069, 50=0.0376, 100=0.0307, 500=0.02192, 1000=0.01722, 2500=0.01566, 5000=0.0144 (USD); Mount: Surface Mount; Case Code (Metric): 0603; Case Code (Imperial): 0201; Weight: 6E-06oz; Dielectric Material: Ceramic; Min Operating Temperature: -55°C; Max Operating Temperature: 85°C; Package Quantity: 15000; Packaging: Tape and Reel; Capacitance: 100nF; Tolerance: 10%; Dielectric: X5R; Termination: SMD/SMT; Voltage Rating (DC): 25V; Series: C; Length: 0.6mm; Width: 0.3mm; Height: 0.3mm; Depth: 0.3mm; Reach SVHC Compliant: No; Lead Free: Lead Free; RoHS Compliant: Yes; ComponentLink1URL: https://datasheet.ciiva.com/14915/tdkmlcccaprange-14915358.pdf?src-supplier=Digi-Key; ComponentLink1Description: https://datasheet.ciiva.com/14915/tdkmlcccaprange-14915358.pdf?src-supplier=Digi-Key; Supplier Part Number 1: 445-13671-1-ND
U?#15 = IC_RK3399-FCBGA828: as U?#1 on sheet RK3399_LPDDR4_Pins; Manufacturer Part Number: RK3399; Case/Package: FCBGA828; Supplier-1: Rockchip
Y?#2 = XTAL_24Mhz-12pF-4-SMD: 24MHz ±20ppm Crystal 12pF 50 Ohms 4-SMD, No Lead /; Manufacturer: Abracon LLC; Manufacturer Part Number: ABM8AIG-24.000MHZ-12-2Z-T3; Case/Package: SMD; Supplier-1: Digikey